# Altium project W2-FRONT.PrjPcb
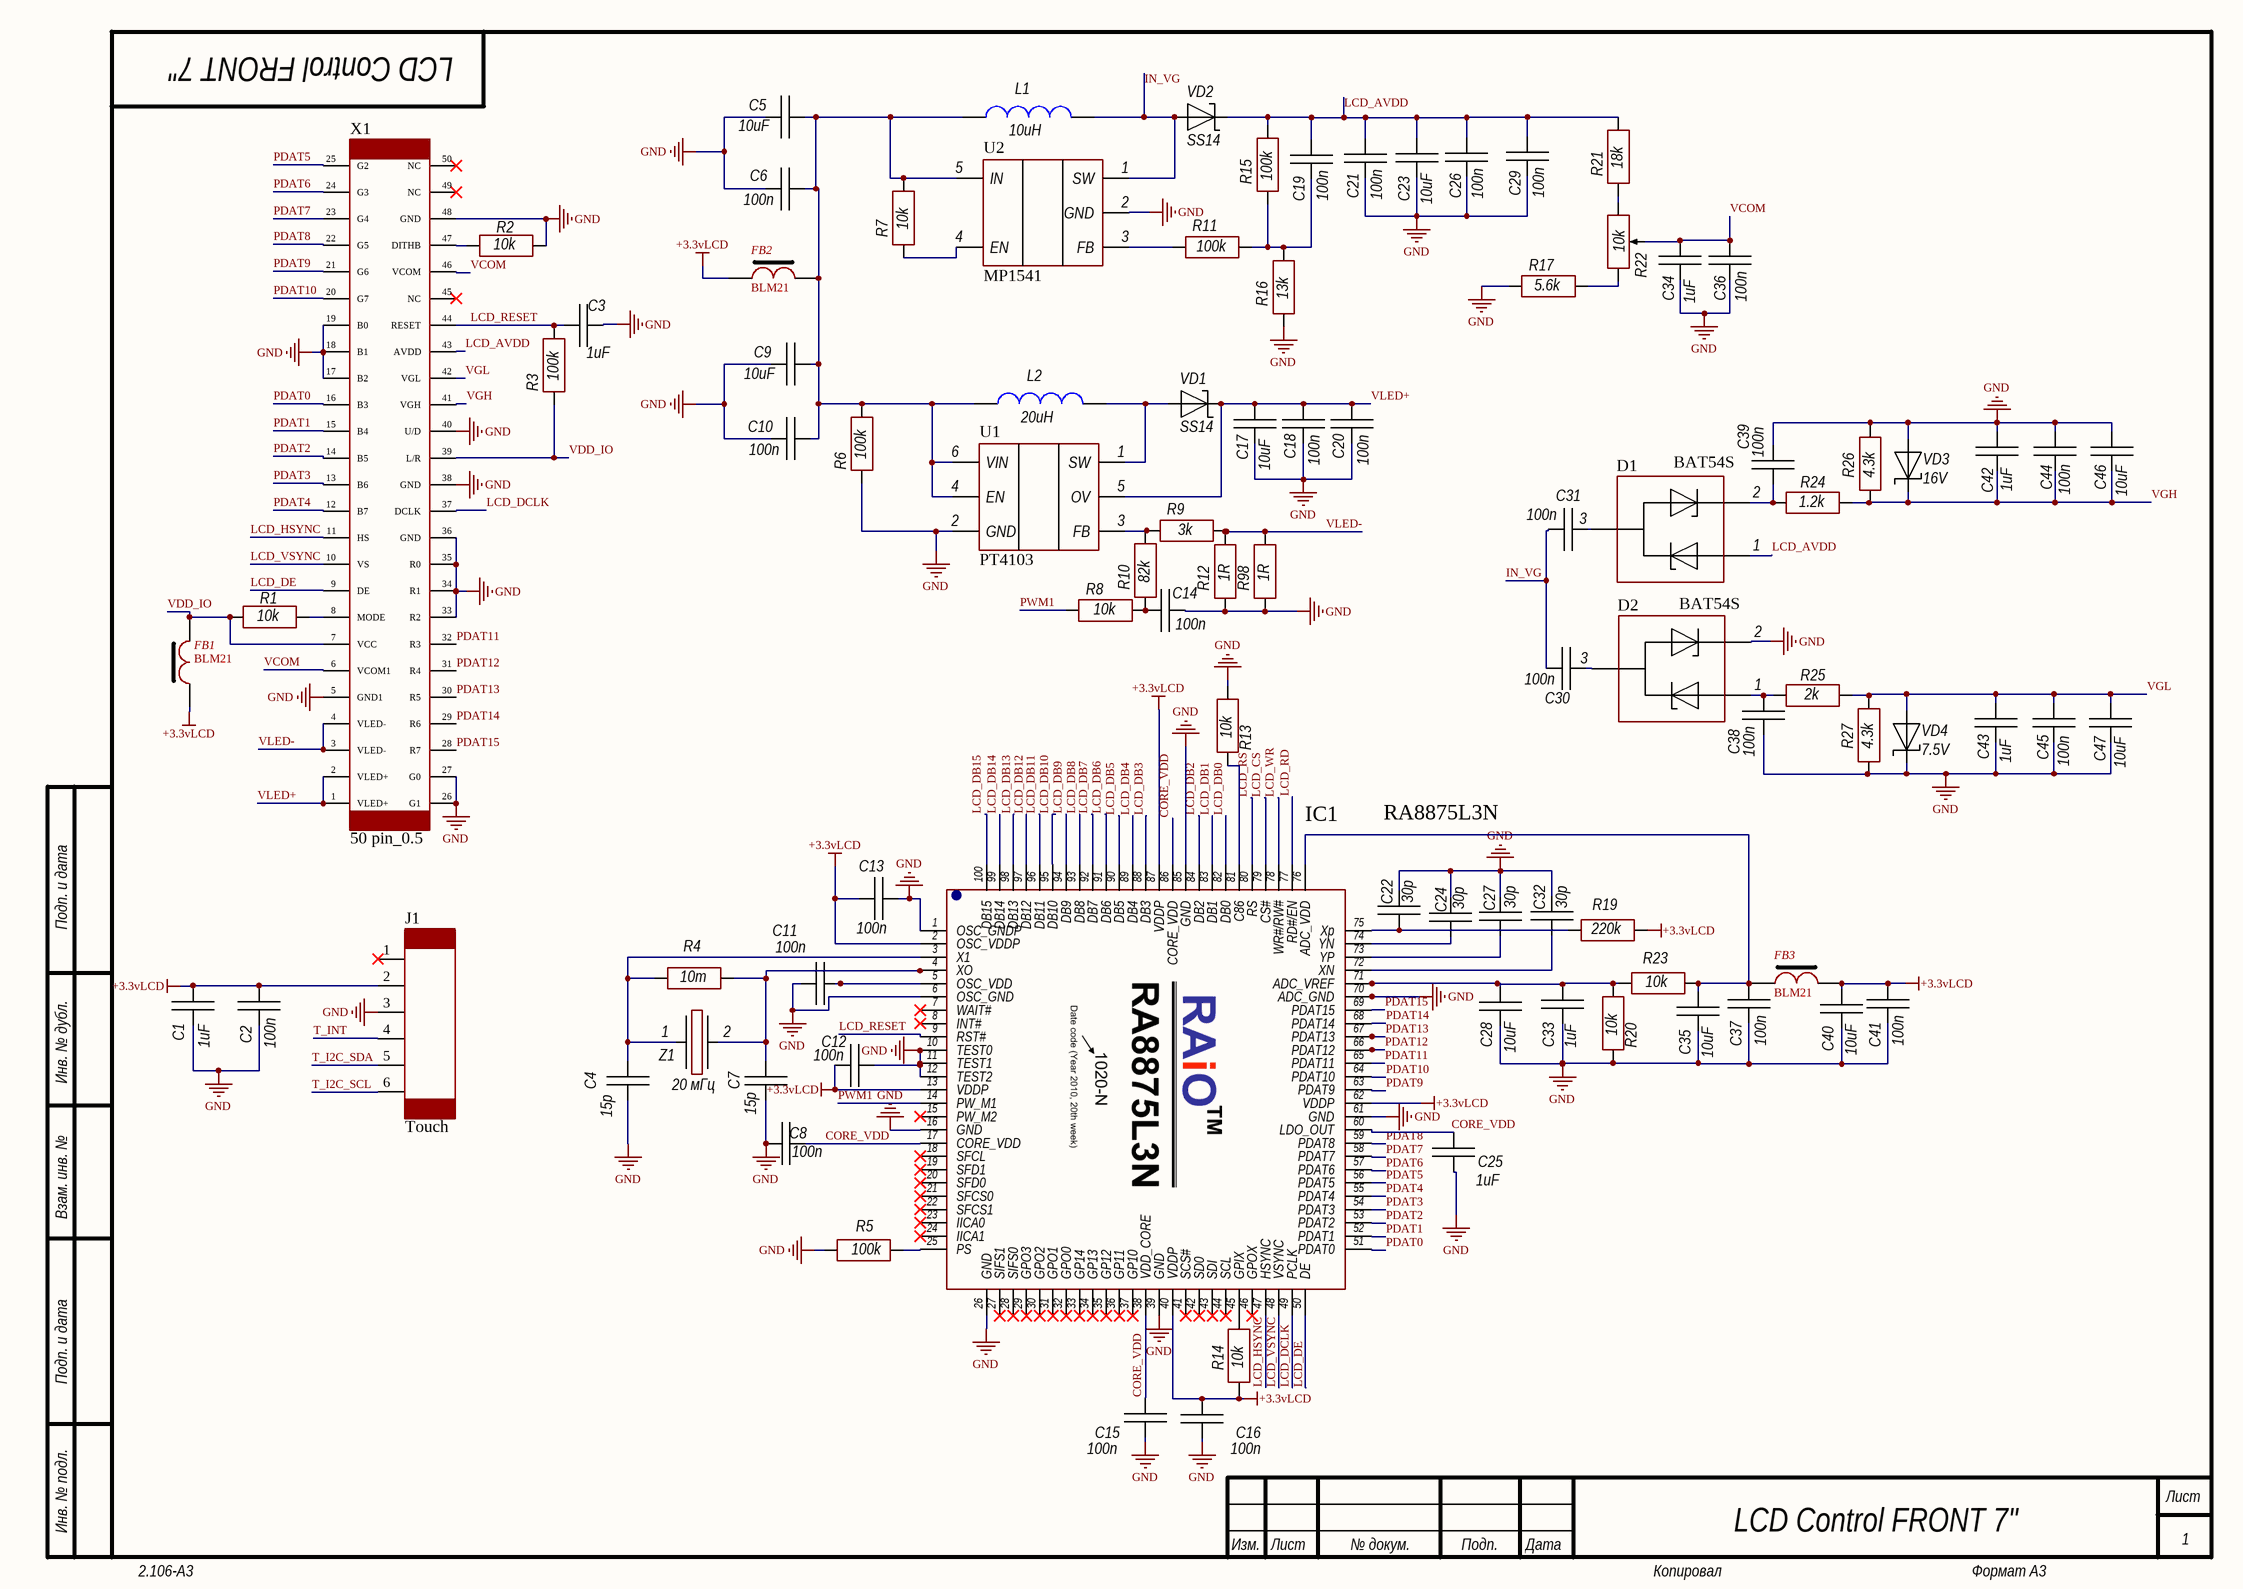
[diagram p0: LCD.SchDoc]
6 sheets, 320 parts. Net scope: global (net labels, ports and power ports of the same name join across sheets).
Board file: PCB_FRONT.PcbDoc
Sheets:
  LCD.SchDoc
  Power.SchDoc
  Conn.SchDoc
  Codec.SchDoc
  STM32.SchDoc
  Control.SchDoc

## Sheet LCD.SchDoc
size 420 x 297 mm; Address1: Address1; Address2: Address2; Address3: Address3; Address4: Address4; DocumentNumber: LCD Control FRONT 7"; SheetNumber: 1; SheetTotal: 6; Scale: 1:1; DocumentType: Схема электрическая принципиальная; FirstReferrence: АБВГ.123456.001

### Parts
C1  1uF  [CH0805C]
C2  100n  [CH0805C]
C3  1uF  [CH0603C]
C4  15p  [CH0603C]
C5  10uF  [CH1206C]
C6  100n  [CH0603C]
C7  15p  [CH0603C]
C8  100n  [CH0603C]
C9  10uF  [CH1206C]
C10  100n  [CH0603C]
C11  100n  [CH0603C]
C12  100n  [CH0603C]
C13  100n  [CH0603C]
C14  100n  [CH0603C]
C15  100n  [CH0603C]
C16  100n  [CH0603C]
C17  10uF  [CH1206C]
C18  100n  [CH0603C]
C19  100n  [CH0603C]
C20  100n  [CH0603C]
C21  100n  [CH0603C]
C22  30p  [CH0603C]
C23  10uF  [CH1206C]
C24  30p  [CH0603C]
C25  1uF  [CH0603C]
C26  100n  [CH0603C]
C27  30p  [CH0603C]
C28  10uF  [CH1206C]
C29  100n  [CH0603C]
C30  100n  [CH0603C]
C31  100n  [CH0603C]
C32  30p  [CH0603C]
C33  1uF  [CH0603C]
C34  1uF  [CH1206C]
C35  10uF  [CH1206C]
C36  100n  [CH0603C]
C37  100n  [CH0603C]
C38  100n  [CH0603C]
C39  100n  [CH0603C]
C40  10uF  [CH1206C]
C41  100n  [CH0603C]
C42  1uF  [CH0603C]
C43  1uF  [CH0603C]
C44  100n  [CH0603C]
C45  100n  [CH0603C]
C46  10uF  [CH1206C]
C47  10uF  [CH1206C]
D1  BAT54S  [SOT23_132]
D2  BAT54S  [SOT23_132]
FB1  BLM21  [CH0805L]
FB2  BLM21  [CH0805L]
FB3  BLM21  [CH0805L]
IC1  RA8875L3N  [100-LQFP]
J1  Touch  [FFC-6PIN]
L1  10uH  [IND: SDR0403]
L2  20uH  [IND: SDR0403]
R1  10k  [CH0603R]
R2  10k  [CH0603R]
R3  100k  [CH0603R]
R4  10m  [CH0603R]
R5  100k  [CH0603R]
R6  100k  [CH0603R]
R7  10k  [CH0603R]
R8  10k  [CH0603R]
R9  3k  [CH0603R]
R10  82k  [CH0603R]
R11  100k  [CH0603R]
R12  1R  [CH0603R]
R13  10k  [CH0603R]
R14  10k  [CH0603R]
R15  100k  [CH0603R]
R16  13k  [CH0603R]
R17  5.6k  [CH0603R]
R19  220k  [CH0603R]
R20  10k  [CH0603R]
R21  18k  [CH0603R]
R22  10k  [RES: 3314G]
R23  10k  [CH0603R]
R24  1.2k  [CH0603R]
R25  2k  [CH0603R]
R26  4.3k  [CH0603R]
R27  4.3k  [CH0603R]
R98  1R  [CH0603R]
U1  PT4103  [SOT23-6-ASM]
U2  MP1541  [SOT23-5]
VD1  SS14  [SMA]
VD2  SS14  [SMA]
VD3  16V  [SOD123]
VD4  7.5V  [SOD123]
X1  50 pin_0.5  [FFC FPC 50]
Z1  20 мГц  [OSC: Hz]

### Nets
+3.3vLCD: C1.2 C2.2 C12.1 C13.1 C16.2 C40.2 C41.2 FB1.2 FB2.2 FB3.1 IC1.2(OSC_VDDP) IC1.13(VDDP) IC1.40(VDDP) IC1.62(VDDP) IC1.87(VDDP) J1.2(B0) R14.1 R19.2
GND: C1.1 C2.1 C3.2 C4.1 C5.1 C6.1 C7.1 C8.1 C9.1 C10.1 C11.1 C12.2 C13.2 C14.2 C15.1 C16.1 C17.1 C18.1 C20.1 C21.1 C22.2 C23.1 C24.2 C25.1 C26.1 C27.2 C28.1 C29.1 C32.2 C33.1 C34.1 C35.1 C36.1 C37.1 C38.1 C39.2 C40.1 C41.1 C42.2 C43.1 C44.2 C45.1 C46.2 C47.1 D2.2 IC1.1(OSC_GNDP) IC1.6(OSC_GND) IC1.10(TEST0) IC1.11(TEST1) IC1.12(TEST2) IC1.16(GND) IC1.26(GND) IC1.39(GND) IC1.61(GND) IC1.70(ADC_GND) IC1.85(GND) J1.3(B1) R2.2 R5.1 R6.1 R12.1 R13.2 R16.1 R17.1 R20.1 R26.2 R27.1 R98.1 U1.2(GND) U2.2(GND) VD3.1 VD4.2 X1.5(GND1) X1.17(B2) X1.18(B1) X1.19(B0) X1.26(G1) X1.27(G0) X1.33(R2) X1.34(R1) X1.35(R0) X1.36(GND) X1.38(GND) X1.40(U/D) X1.48(GND)
CORE_VDD: C8.2 C15.2 C25.2 IC1.17(CORE_VDD) IC1.38(VDD_CORE) IC1.60(LDO_OUT) IC1.86(CORE_VDD)
IN_VG: C30.1 C31.1 L1.1 U2.1(SW) VD2.1
LCD_AVDD: C19.2 C21.2 C23.2 C26.2 C29.2 D1.1 R15.2 R21.2 VD2.2 X1.43(AVDD)
LCD_CS: IC1.79(CS#)
LCD_DB0: IC1.82(DB0)
LCD_DB1: IC1.83(DB1)
LCD_DB2: IC1.84(DB2)
LCD_DB3: IC1.88(DB3)
LCD_DB4: IC1.89(DB4)
LCD_DB5: IC1.90(DB5)
LCD_DB6: IC1.91(DB6)
LCD_DB7: IC1.92(DB7)
LCD_DB8: IC1.93(DB8)
LCD_DB9: IC1.94(DB9)
LCD_DB10: IC1.95(DB10)
LCD_DB11: IC1.96(DB11)
LCD_DB12: IC1.97(DB12)
LCD_DB13: IC1.98(DB13)
LCD_DB14: IC1.99(DB14)
LCD_DB15: IC1.100(DB15)
LCD_DCLK: IC1.49(PCLK) X1.37(DCLK)
LCD_DE: IC1.50(DE) X1.9(DE)
LCD_HSYNC: IC1.47(HSYNC) X1.11(HS)
LCD_RD: IC1.77(RD#/EN)
LCD_RESET: C3.1 IC1.9(RST#) R3.2 X1.44(RESET)
LCD_RS: IC1.80(RS)
LCD_VSYNC: IC1.48(VSYNC) X1.10(VS)
LCD_WR: IC1.78(WR#/RW#)
PDAT0: IC1.51(PDAT0) X1.16(B3)
PDAT1: IC1.52(PDAT1) X1.15(B4)
PDAT2: IC1.53(PDAT2) X1.14(B5)
PDAT3: IC1.54(PDAT3) X1.13(B6)
PDAT4: IC1.55(PDAT4) X1.12(B7)
PDAT5: IC1.56(PDAT5) X1.25(G2)
PDAT6: IC1.57(PDAT6) X1.24(G3)
PDAT7: IC1.58(PDAT7) X1.23(G4)
PDAT8: IC1.59(PDAT8) X1.22(G5)
PDAT9: IC1.63(PDAT9) X1.21(G6)
PDAT10: IC1.64(PDAT10) X1.20(G7)
PDAT11: IC1.65(PDAT11) X1.32(R3)
PDAT12: IC1.66(PDAT12) X1.31(R4)
PDAT13: IC1.67(PDAT13) X1.30(R5)
PDAT14: IC1.68(PDAT14) X1.29(R6)
PDAT15: IC1.69(PDAT15) X1.28(R7)
PWM1: IC1.14(PW_M1) R8.1
T_I2C_SCL: J1.6(B4)
T_I2C_SDA: J1.5(B3)
T_INT: J1.4(B2)
VCOM: C34.2 C36.2 R22.2 X1.6(VCOM1) X1.46(VCOM)
VDD_IO: FB1.1 R1.1 R3.1 X1.7(VCC) X1.39(L/R)
VGH: C42.1 C44.1 C46.1 R24.2 R26.1 VD3.2 X1.41(VGH)
VGL: C43.2 C45.2 C47.2 R25.2 R27.2 VD4.1 X1.42(VGL)
VLED+: C17.2 C18.2 C20.2 U1.5(OV) VD1.2 X1.1(VLED+) X1.2(VLED+)
VLED-: R9.2 R12.2 R98.2 X1.3(VLED-) X1.4(VLED-)
NetC4_2: C4.2 IC1.3(X1) R4.1 Z1.1
NetC5_2: C5.2 C6.2 C9.2 C10.2 FB2.1 L1.2 L2.2 R6.2 R7.2 U1.4(EN) U1.6(VIN) U2.5(IN)
NetC7_2: C7.2 IC1.4(XO) R4.2 Z1.2
NetC11_2: C11.2 IC1.5(OSC_VDD)
NetC14_1: C14.1 R8.2 R10.1
NetC19_1: C19.1 R11.2 R15.1 R16.2
NetC22_1: C22.1 IC1.75(Xp) R19.1
NetC24_1: C24.1 IC1.74(YN)
NetC27_1: C27.1 IC1.73(YP)
NetC28_2: C28.2 C33.2 IC1.71(ADC_VREF) R20.2 R23.1
NetC30_2: C30.2 D2.3
NetC31_2: C31.2 D1.3
NetC32_1: C32.1 IC1.72(XN)
NetC35_2: C35.2 C37.2 FB3.2 IC1.76(ADC_VDD) R23.2
NetC38_2: C38.2 D2.1 R25.1
NetC39_1: C39.1 D1.2 R24.1
NetIC1_25: IC1.25(PS) R5.2
NetIC1_45: IC1.45(GPIX) R14.2
NetIC1_81: IC1.81(C86) R13.1
NetL2_1: L2.1 U1.1(SW) VD1.1
NetR1_2: R1.2 X1.8(MODE)
NetR2_1: R2.1 X1.47(DITHB)
NetR7_1: R7.1 U2.4(EN)
NetR9_1: R9.1 R10.2 U1.3(FB)
NetR11_1: R11.1 U2.3(FB)
NetR17_2: R17.2 R22.3
NetR21_1: R21.1 R22.1

Not connected (* = marked no-connect by the designer): IC1 7(WAIT#)* 8(INT#)* 15(PW_M2)* 18(SFCL)* 19(SFD1)* 20(SFD0)* 21(SFCS0)* 22(SFCS1)* 23(IICA0)* 24(IICA1)* 27(SIFS1)* 28(SIFS0)* 29(GPO3)* 30(GPO2)* 31(GPO1)* 32(GPO0)* 33(GP14)* 34(GP13)* 35(GP12)* 36(GP11)* 37(GP10)* 41(SCS#)* 42(SD0)* 43(SDI)* 44(SCL)* 46(GPOX)*; J1 1(G7)*; X1 45(NC)* 49(NC)* 50(NC)*

### Notes on the sheet
- Подп. и дата
- Инв. № дубл.
- Взам. инв. №
- Инв. № подл.
- Изм.
- Лист
- № докум.
- Подп.
- Дата
- 2.106-A3
- Копировал
- Формат А3
- (in symbol RA8875) .

### Library data of the parts
C1-C47 = Capacitor: Manufacturer: *; Model: *; HelpURL: *; ComponentKind: *; Value: *
D1 D2 = BAT54
FB1-FB3 = FB-1
IC1 = RA8875
J1 = 6-Conn
L1 L2 = Inductor: Manufacturer: *; Model: *; HelpURL: *; ComponentKind: *; Value: *
R1-R17 R19-R21 R23-R27 R98 = Resistor: Manufacturer: *; Model: *; HelpURL: *; ComponentKind: *; Value: *
R22 = ADJ resistor: Manufacturer: *; Model: *; HelpURL: *; ComponentKind: *; Value: *
U1 = MP3202
VD1-VD4 = Diod Schottky: ComponentKind: *; Manufacturer: *; Model: *; HelpURL: *
X1 = 50-Conn
Z1 = Oscillator: Manufacturer: *; Model: *; HelpURL: *; ComponentKind: *; Value: *

## Sheet Power.SchDoc
size 420 x 297 mm; Address1: Address1; Address2: Address2; Address3: Address3; Address4: Address4; DocumentNumber: Power FRONT 7"; SheetNumber: 2; SheetTotal: 6; Scale: 1:1; DocumentType: Схема электрическая принципиальная; FirstReferrence: АБВГ.123456.001
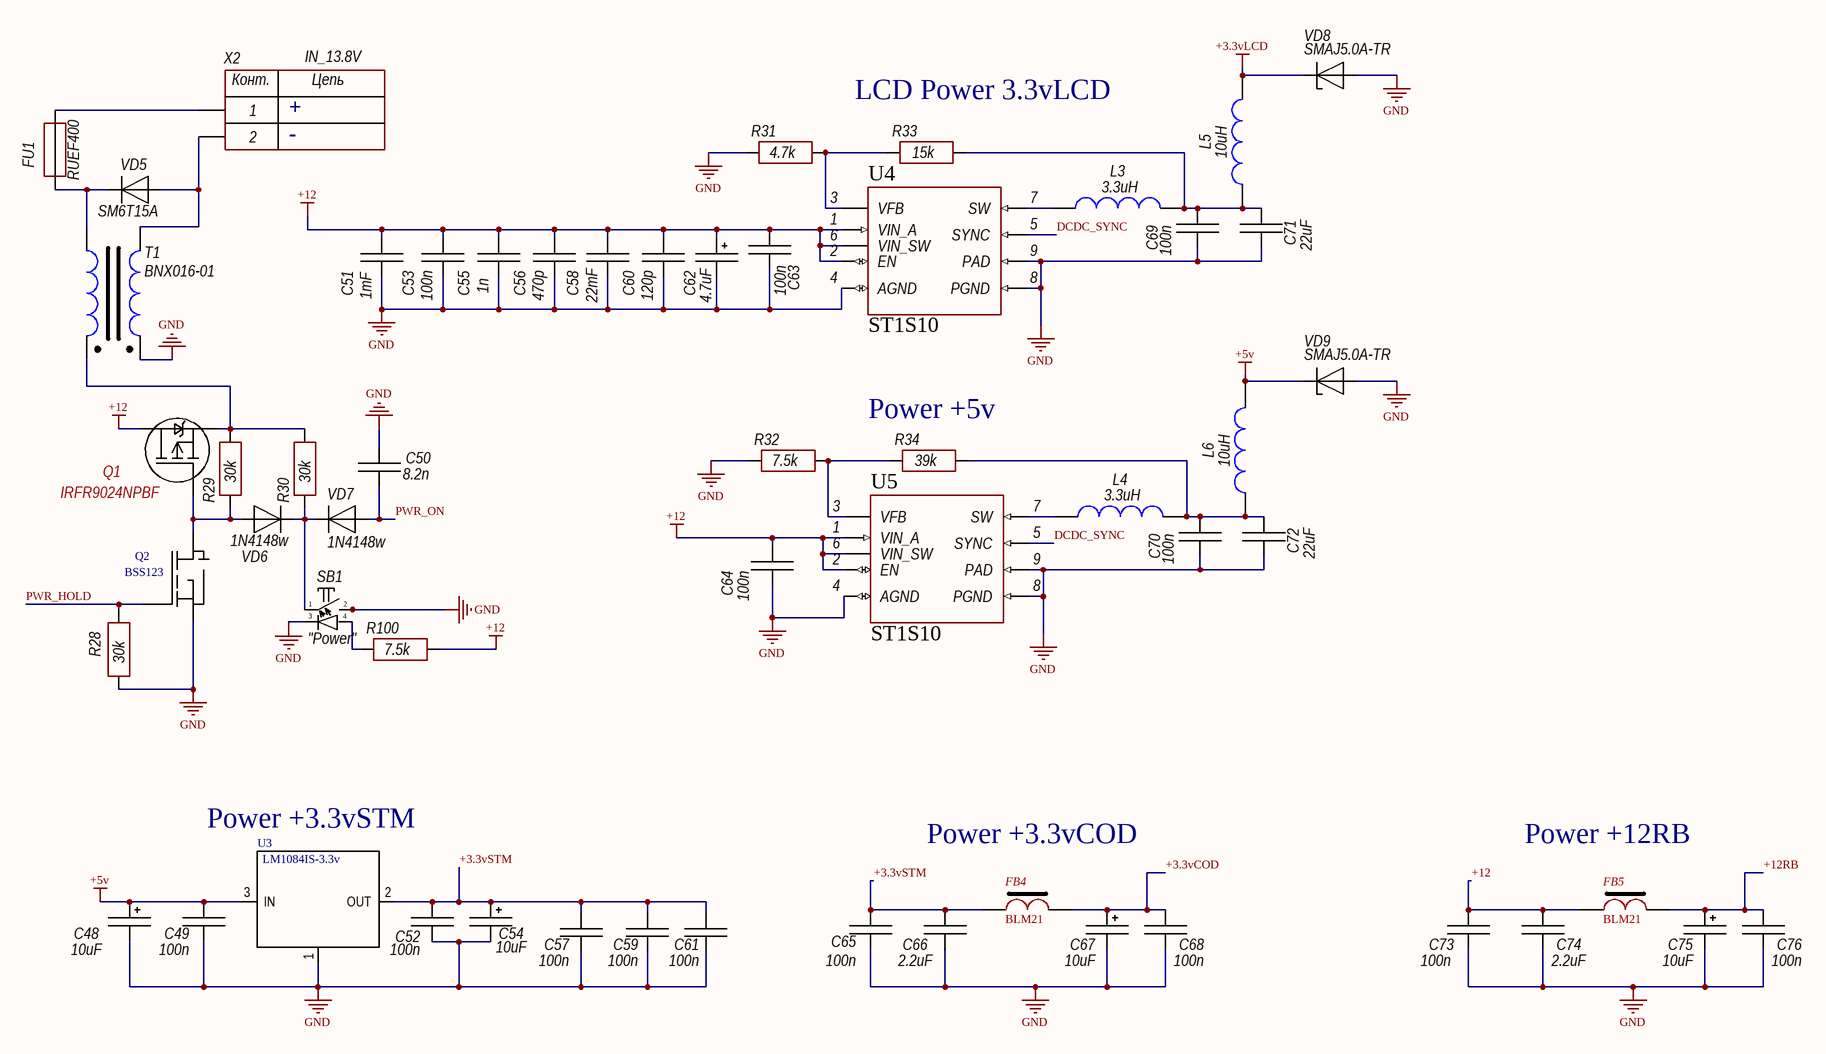
[diagram p1: Power.SchDoc]

### Parts
C48  10uF  [TANTAL_B]
C49  100n  [CH0805C]
C50  8.2n  [CH0805C]
C51  1mF  [CH0805C]
C52  100n  [CH0805C]
C53  100n  [CH0805C]
C54  10uF  [TANTAL_B]
C55  1n  [CH0805C]
C56  470p  [CH0805C]
C57  100n  [CH0805C]
C58  22mF  [CH1210C]
C59  100n  [CH0805C]
C60  120p  [CH0805C]
C61  100n  [CH0805C]
C62  4.7uF  [D6.3C2.5H11]
C63  100n  [CH0805C]
C64  100n  [CH0805C]
C65  100n  [CH0805C]
C66  2.2uF  [CH0805C]
C67  10uF  [TANTAL_B]
C68  100n  [CH0805C]
C69  100n  [CH0805C]
C70  100n  [CH0805C]
C71  22uF  [CH1210C]
C72  22uF  [CH1210C]
C73  100n  [CH0805C]
C74  2.2uF  [CH0805C]
C75  10uF  [TANTAL_B]
C76  100n  [CH0805C]
FB4  BLM21  [CH0805L]
FB5  BLM21  [CH0805L]
FU1  RUEF400  [Fuse: Ruef400]
L3  3.3uH  [IND: CDRH74]
L4  3.3uH  [IND: CDRH127]
L5  10uH  [IND: CDRH74]
L6  10uH  [IND: CDRH74]
Q1  IRFR9024NPBF  [D2PAK_132]
Q2  BSS123  [SOT23_132]
R28  30k  [CH0805R]
R29  30k  [CH0805R]
R30  30k  [CH0805R]
R31  4.7k  [CH0805R]
R32  7.5k  [CH0805R]
R33  15k  [CH0805R]
R34  39k  [CH0805R]
R100  7.5k  [CH0805R]
SB1  "Power"  [BUT: 6x6 LED]
T1  BNX016-01  [BNX016-01]
U3  LM1084IS-3.3v  [TO-263-3(123)]
U4  ST1S10  [8-SOIC (PAD)]
U5  ST1S10  [8-SOIC (PAD)]
VD5  SM6T15A  [SMB]
VD6  1N4148w  [SOD123F]
VD7  1N4148w  [SOD123F]
VD8  SMAJ5.0A-TR  [SMA]
VD9  SMAJ5.0A-TR  [SMA]
X2  IN_13.8V  [CON: WF-02]

### Nets
+3.3vCOD: C67.1 C68.2 FB4.1
+3.3vLCD: L5.1 VD8.2(C)
+3.3vSTM: C52.2 C54.1 C57.2 C59.2 C61.2 C65.2 C66.2 FB4.2 U3.2(OUT)
+5v: C48.1 C49.2 L6.1 U3.3(IN) VD9.2(C)
+12: C51.2 C53.2 C55.2 C56.2 C58.2 C60.2 C62.1 C63.2 C64.2 C73.2 C74.2 FB5.2 Q1.3(Сток(Drain)) R100.2 U4.1(VIN_A) U4.2(EN) U4.6(VIN_SW) U5.1(VIN_A) U5.2(EN) U5.6(VIN_SW)
+12RB: C75.1 C76.2 FB5.1
GND: C48.2 C49.1 C50.2 C51.1 C52.1 C53.1 C54.2 C55.1 C56.1 C57.1 C58.1 C59.1 C60.1 C61.1 C62.2 C63.1 C64.1 C65.1 C66.1 C67.2 C68.1 C69.1 C70.1 C71.1 C72.1 C73.1 C74.1 C75.2 C76.1 Q2.2(S) R28.1 R31.1 R32.1 SB1.2 SB1.3 T1.3 U3.1 U4.4(AGND) U4.8(PGND) U4.9(PAD) U5.4(AGND) U5.8(PGND) U5.9(PAD) VD8.1(A) VD9.1(A)
DCDC_SYNC: U4.5(SYNC) U5.5(SYNC)
PWR_HOLD: Q2.1(G) R28.2
PWR_ON: C50.1 VD7.1
NetC69_2: C69.2 C71.2 L3.1 L5.2 R33.2
NetC70_2: C70.2 C72.2 L4.1 L6.2 R34.2
NetFU1_1: FU1.1 T1.2 VD5.2
NetFU1_2: FU1.2 X2.1
NetL3_2: L3.2 U4.7(SW)
NetL4_2: L4.2 U5.7(SW)
NetQ1_1: Q1.1(Затвор(Gate)) Q2.3(D) R29.1 VD6.1
NetQ1_2: Q1.2(I) R29.2 R30.2 T1.1
NetR30_1: R30.1 SB1.1 VD6.2 VD7.2
NetR31_2: R31.2 R33.1 U4.3(VFB)
NetR32_2: R32.2 R34.1 U5.3(VFB)
NetR100_1: R100.1 SB1.4
NetT1_4: T1.4 VD5.1 X2.2

### Notes on the sheet
- +
- -
- LCD Power 3.3vLCD
- (near R34) Power +5v
- Power +3.3vSTM
- Power +3.3vCOD
- Power +12RB
- Подп. и дата
- Инв. № дубл.
- Взам. инв. №
- Инв. № подл.
- Изм.
- Лист
- № докум.
- Подп.
- Дата
- 2.106-A3
- Копировал
- Формат А3
- (in symbol 2-Connector) Конт.; Цепь

### Library data of the parts
C48 C54 C67 C75 = TantalCap: Manufacturer: *; Model: *; HelpURL: *; ComponentKind: *; Value: *
C49-C53 C55-C61 C63-C66 C68-C74 C76 = Capacitor: Manufacturer: *; Model: *; HelpURL: *; ComponentKind: *; Value: *
C62 = AlumCap: Manufacturer: *; Model: *; HelpURL: *; ComponentKind: *; Value: *
FB4 FB5 = FB-1
FU1 = Fuse: Manufacturer: *; Model: *; HelpURL: *; ComponentKind: *; Value: *
L3-L6 = Inductor: Manufacturer: *; Model: *; HelpURL: *; ComponentKind: *; Value: *
Q1 = P-KANAL
R28-R34 R100 = Resistor: Manufacturer: *; Model: *; HelpURL: *; ComponentKind: *; Value: *
SB1 = Tactile switches_LED: 6x6 mm; Manufacturer: *; Model: *; HelpURL: *; ComponentKind: *
T1 = EMI bead: Manufacturer: Murata Electronics North America; Model: DLW21SN900SQ2L; HelpURL: https://www.digikey.com/product-detail/en/murata-electronics-north-america/DLW21SN900SQ2L/490-5137-1-ND/1922888; ComponentKind: Bead
U3 = LM1084
VD5-VD7 = Diod: ComponentKind: *; Manufacturer: *; Model: *; HelpURL: *
VD8 VD9 = Diod Zener: ComponentKind: *; Manufacturer: *; Model: *; HelpURL: *
X2 = 2-Connector: Model: *; Manufacturer: *; HelpURL: *; ComponentKind: *

## Sheet Conn.SchDoc: Connectros
size 420 x 297 mm; Author: UA3REO; CompanyName: Wolf Team; Engineer: UA3REO; DocumentNumber: Connectors FRONT 7'; Revision: 0.1; SheetNumber: 3; SheetTotal: 6
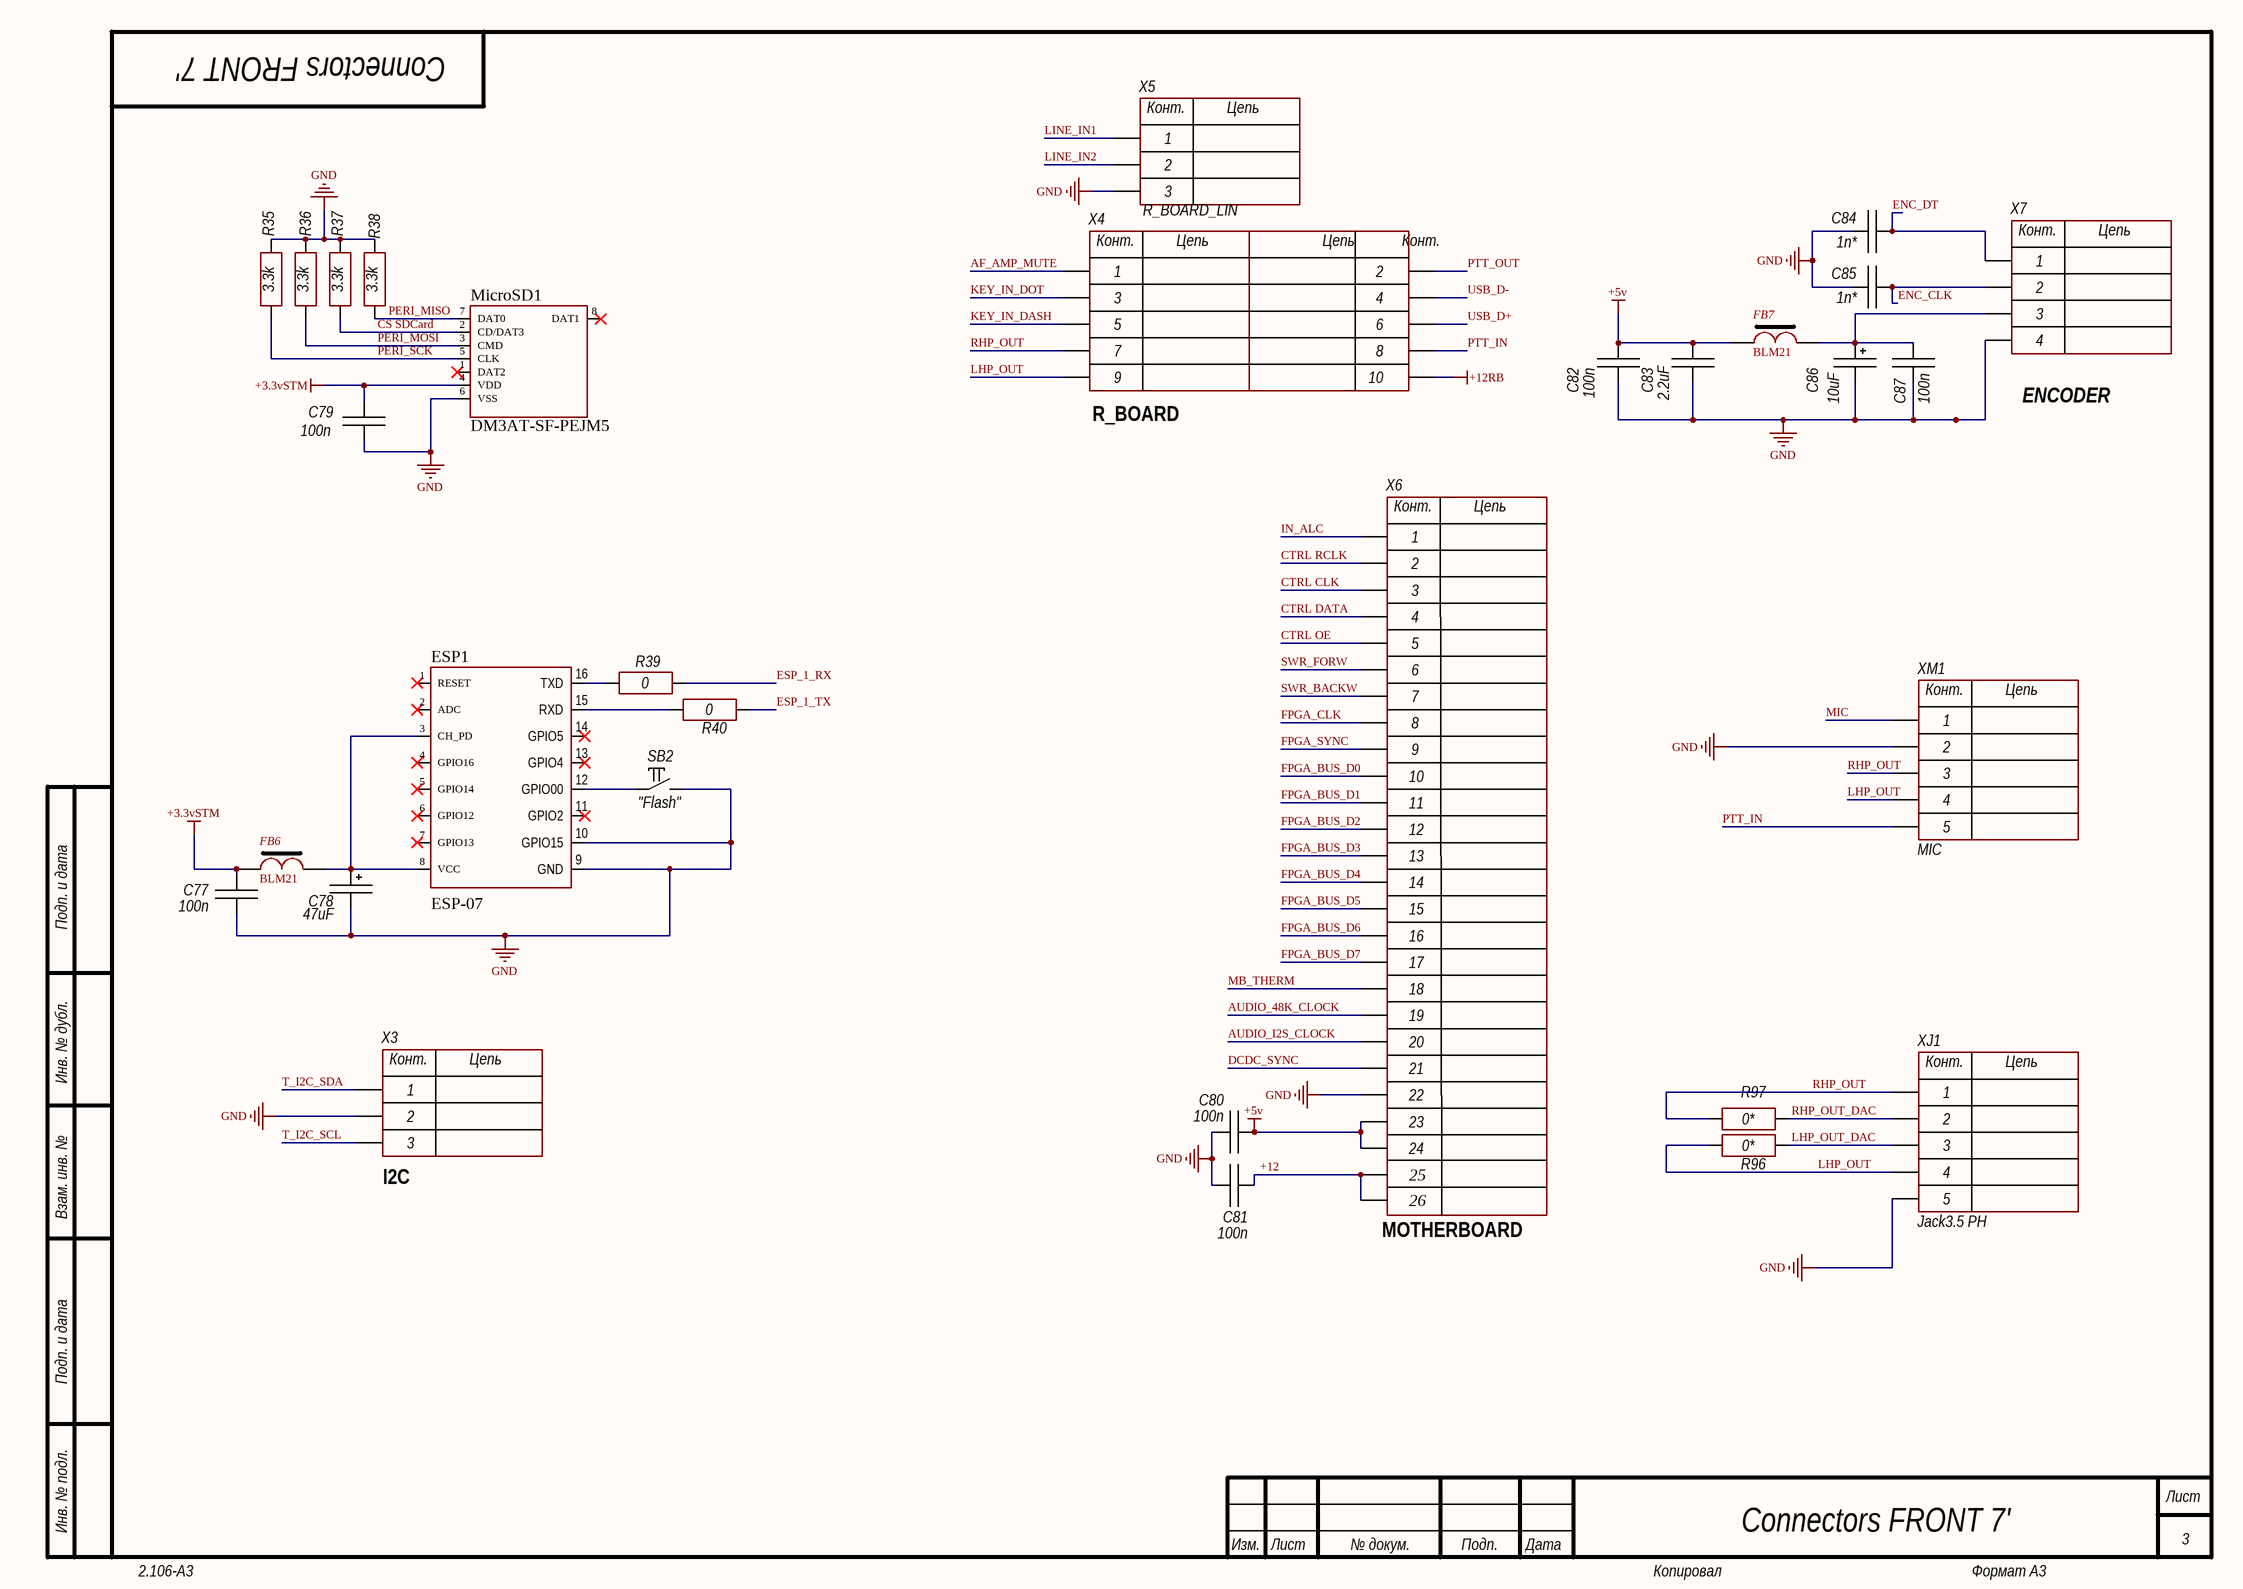
[diagram p2: Conn.SchDoc]

### Parts
C77  100n  [CH0805C]
C78  47uF  [TANTAL_C]
C79  100n  [CH0805C]
C80  100n  [CH0805C]
C81  100n  [CH0805C]
C82  100n  [CH0805C]
C83  2.2uF  [CH0805C]
C84  1n*  [CH0805C]
C85  1n*  [CH0805C]
C86  10uF  [TANTAL_B]
C87  100n  [CH0805C]
ESP1  ESP-07  [ESP8266 ESP-07]
FB6  BLM21  [CH0805L]
FB7  BLM21  [CH0805L]
MicroSD1  DM3AT-SF-PEJM5  [SD-card]
R35  3.3k  [CH0805R]
R36  3.3k  [CH0805R]
R37  3.3k  [CH0805R]
R38  3.3k  [CH0805R]
R39  0  [CH0603R]
R40  0  [CH0603R]
R96  0*  [CH0603R]
R97  0*  [CH0603R]
SB2  "Flash"  [BUT: 6x6 SMD]
X3  I2C  [CON: CWF-3]
X4  R_BOARD  [CON: BH-10]
X5  R_BOARD_LIN  [CON: CWF-3]
X6  MOTHERBOARD  [CON: IDC-26]
X7  ENCODER  [CON: CWF-4]
XJ1  Jack3.5 PH  [CON: PLS-5]
XM1  MIC  [CON: PLS-5]

### Nets
+3.3vSTM: C77.2 C79.2 FB6.2 MicroSD1.4(VDD)
+5v: C80.1 C82.2 C83.2 FB7.2 X6.23 X6.24
+12: C81.1 X6.25 X6.26
+12RB: X4.10
GND: C77.1 C78.2 C79.1 C80.2 C81.2 C82.1 C83.1 C84.1 C85.1 C86.2 C87.1 ESP1.9(GND) ESP1.10(GPIO15) MicroSD1.6(VSS) R35.2 R36.2 R37.2 R38.2 SB2.2 X3.2 X5.3 X6.22 X7.4 XJ1.5 XM1.2
AF_AMP_MUTE: X4.1
AUDIO_48K_CLOCK: X6.19
AUDIO_I2S_CLOCK: X6.20
CS SDCard: MicroSD1.2(CD/DAT3) R37.1
CTRL CLK: X6.3
CTRL DATA: X6.4
CTRL OE: X6.5
CTRL RCLK: X6.2
DCDC_SYNC: X6.21
ENC_CLK: C85.2 X7.2
ENC_DT: C84.2 X7.1
ESP_1_RX: R39.2
ESP_1_TX: R40.2
FPGA_BUS_D0: X6.10
FPGA_BUS_D1: X6.11
FPGA_BUS_D2: X6.12
FPGA_BUS_D3: X6.13
FPGA_BUS_D4: X6.14
FPGA_BUS_D5: X6.15
FPGA_BUS_D6: X6.16
FPGA_BUS_D7: X6.17
FPGA_CLK: X6.8
FPGA_SYNC: X6.9
IN_ALC: X6.1
KEY_IN_DASH: X4.5
KEY_IN_DOT: X4.3
LHP_OUT: R96.1 X4.9 XJ1.4 XM1.4
LHP_OUT_DAC: R96.2 XJ1.3
LINE_IN1: X5.1
LINE_IN2: X5.2
MB_THERM: X6.18
MIC: XM1.1
PERI_MISO: MicroSD1.7(DAT0) R38.1
PERI_MOSI: MicroSD1.3(CMD) R36.1
PERI_SCK: MicroSD1.5(CLK) R35.1
PTT_IN: X4.8 XM1.5
PTT_OUT: X4.2
RHP_OUT: R97.1 X4.7 XJ1.1 XM1.3
RHP_OUT_DAC: R97.2 XJ1.2
SWR_BACKW: X6.7
SWR_FORW: X6.6
T_I2C_SCL: X3.3
T_I2C_SDA: X3.1
USB_D+: X4.6
USB_D-: X4.4
NetC78_1: C78.1 ESP1.3(CH_PD) ESP1.8(VCC) FB6.1
NetC86_1: C86.1 C87.2 FB7.1 X7.3
NetESP1_12: ESP1.12(GPIO00) SB2.1
NetESP1_15: ESP1.15(RXD) R40.1
NetESP1_16: ESP1.16(TXD) R39.1

Not connected (* = marked no-connect by the designer): ESP1 1(RESET)* 2(ADC)* 4(GPIO16)* 5(GPIO14)* 6(GPIO12)* 7(GPIO13)* 11(GPIO2)* 13(GPIO4)* 14(GPIO5)*; MicroSD1 1(DAT2)* 8(DAT1)*

### Notes on the sheet
- Подп. и дата
- Инв. № дубл.
- Взам. инв. №
- Инв. № подл.
- Изм.
- Лист
- № докум.
- Подп.
- Дата
- 2.106-A3
- Копировал
- Формат А3
- (in symbol 3-Connector) Конт.; Цепь
- (in symbol 4-Connector) Конт.; Цепь
- (in symbol 5-Connector) Конт.; Цепь
- (in symbol 10(2)-Connector) Конт.; Цепь
- (in symbol 26-Connector) Конт.; Цепь

### Library data of the parts
C77 C79-C85 C87 = Capacitor: Manufacturer: *; Model: *; HelpURL: *; ComponentKind: *; Value: *
C78 C86 = TantalCap: Manufacturer: *; Model: *; HelpURL: *; ComponentKind: *; Value: *
FB6 FB7 = FB-1
MicroSD1 = MicroSD
R35-R40 R96 R97 = Resistor: Manufacturer: *; Model: *; HelpURL: *; ComponentKind: *; Value: *
SB2 = Tactile switches: 6x6 mm; Manufacturer: *; Model: *; HelpURL: *; ComponentKind: *
X3 X5 = 3-Connector: Model: *; Manufacturer: *; HelpURL: *; ComponentKind: *
X4 = 10(2)-Connector: Model: *; Manufacturer: *; HelpURL: *; ComponentKind: *
X6 = 26-Connector: Model: *; Manufacturer: *; HelpURL: *; ComponentKind: *
X7 = 4-Connector: Model: *; Manufacturer: *; HelpURL: *; ComponentKind: *
XJ1 XM1 = 5-Connector: Model: *; Manufacturer: *; HelpURL: *; ComponentKind: *

## Sheet Codec.SchDoc
size 420 x 297 mm; DocumentNumber: CODEC FRONT 7"; SheetNumber: 4; SheetTotal: 6
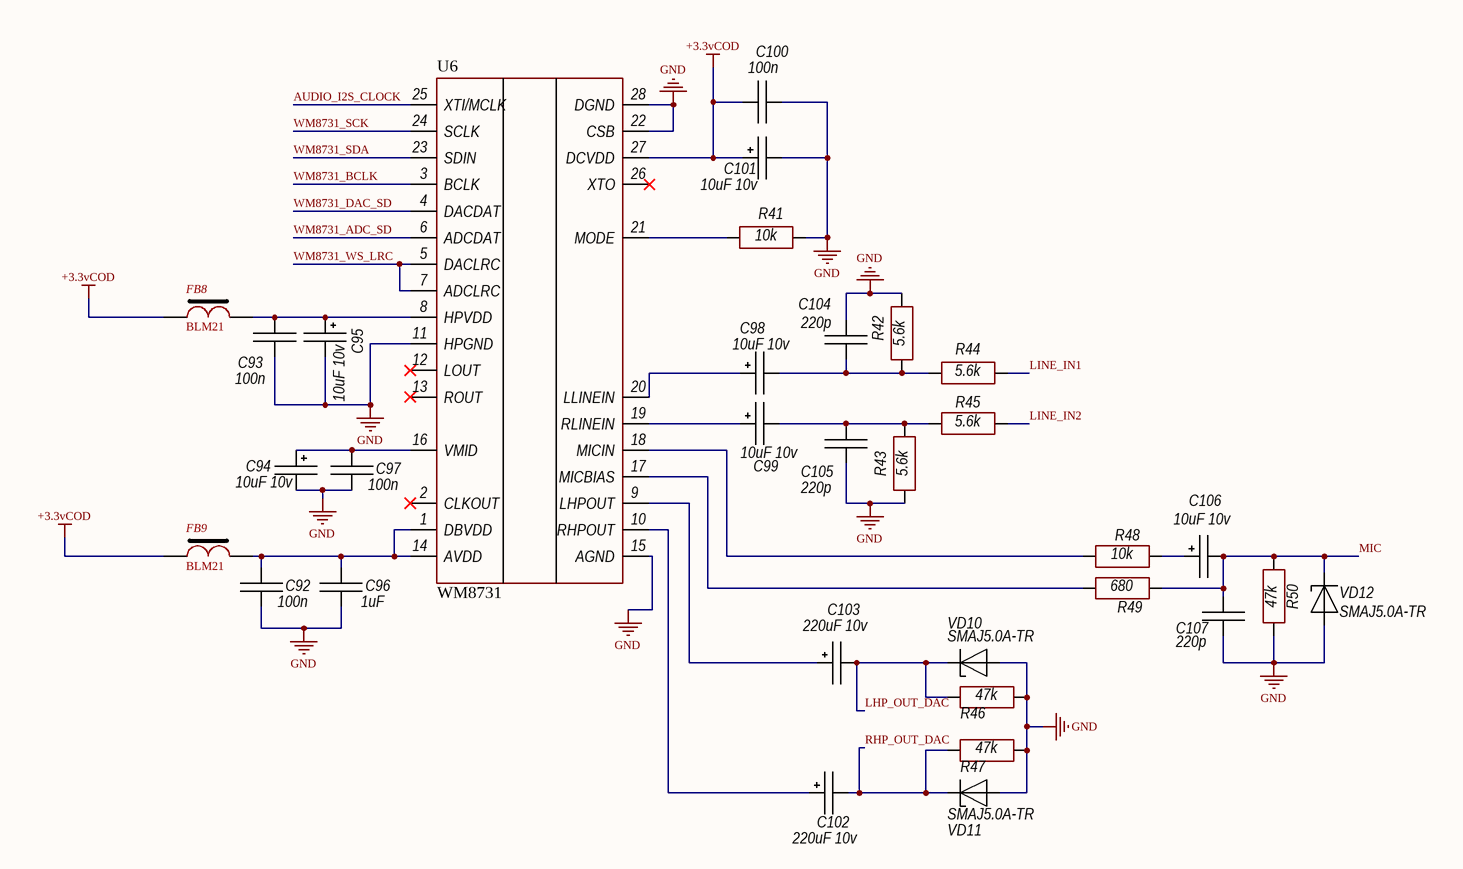
[diagram p3: Codec.SchDoc]

### Parts
C92  100n  [CH0805C]
C93  100n  [CH0805C]
C94  10uF 10v  [TANTAL_B]
C95  10uF 10v  [TANTAL_B]
C96  1uF  [CH0805C]
C97  100n  [CH0805C]
C98  10uF 10v  [TANTAL_B]
C99  10uF 10v  [TANTAL_B]
C100  100n  [CH0805C]
C101  10uF 10v  [TANTAL_B]
C102  220uF 10v  [TANTAL_D]
C103  220uF 10v  [TANTAL_D]
C104  220p  [CH0805C]
C105  220p  [CH0805C]
C106  10uF 10v  [TANTAL_B]
C107  220p  [CH0805C]
FB8  BLM21  [CH0805L]
FB9  BLM21  [CH0805L]
R41  10k  [CH0805R]
R42  5.6k  [CH0805R]
R43  5.6k  [CH0805R]
R44  5.6k  [CH0805R]
R45  5.6k  [CH0805R]
R46  47k  [CH0805R]
R47  47k  [CH0805R]
R48  10k  [CH0805R]
R49  680  [CH0805R]
R50  47k  [CH0805R]
U6  WM8731  [28-SSOP]
VD10  SMAJ5.0A-TR  [SMA]
VD11  SMAJ5.0A-TR  [SMA]
VD12  SMAJ5.0A-TR  [SMA]

### Nets
+3.3vCOD: C100.1 C101.1 FB8.2 FB9.2 U6.27(DCVDD)
GND: C92.1 C93.1 C94.2 C95.2 C96.1 C97.1 C100.2 C101.2 C104.2 C105.1 C107.2 R41.2 R42.2 R43.1 R46.2 R47.2 R50.1 U6.11(HPGND) U6.15(AGND) U6.22(CSB) U6.28(DGND) VD10.1(A) VD11.1(A) VD12.1(A)
AUDIO_I2S_CLOCK: U6.25(XTI/MCLK)
LHP_OUT_DAC: C103.2 R46.1 VD10.2(C)
LINE_IN1: R44.2
LINE_IN2: R45.2
MIC: C106.2 C107.1 R49.2 R50.2 VD12.2(C)
RHP_OUT_DAC: C102.2 R47.1 VD11.2(C)
WM8731_ADC_SD: U6.6(ADCDAT)
WM8731_BCLK: U6.3(BCLK)
WM8731_DAC_SD: U6.4(DACDAT)
WM8731_SCK: U6.24(SCLK)
WM8731_SDA: U6.23(SDIN)
WM8731_WS_LRC: U6.5(DACLRC) U6.7(ADCLRC)
NetC92_2: C92.2 C96.2 FB9.1 U6.1(DBVDD) U6.14(AVDD)
NetC93_2: C93.2 C95.1 FB8.1 U6.8(HPVDD)
NetC94_1: C94.1 C97.2 U6.16(VMID)
NetC98_1: C98.1 U6.20(LLINEIN)
NetC98_2: C98.2 C104.1 R42.1 R44.1
NetC99_1: C99.1 U6.19(RLINEIN)
NetC99_2: C99.2 C105.2 R43.2 R45.1
NetC102_1: C102.1 U6.10(RHPOUT)
NetC103_1: C103.1 U6.9(LHPOUT)
NetC106_1: C106.1 R48.2
NetR41_1: R41.1 U6.21(MODE)
NetR48_1: R48.1 U6.18(MICIN)
NetR49_1: R49.1 U6.17(MICBIAS)

Not connected (* = marked no-connect by the designer): U6 2(CLKOUT)* 12(LOUT)* 13(ROUT)* 26(XTO)*

### Notes on the sheet
- Подп. и дата
- Инв. № дубл.
- Взам. инв. №
- Инв. № подл.
- Изм.
- Лист
- № докум.
- Подп.
- Дата
- 2.106-A3
- Копировал
- Формат А3

### Library data of the parts
C92 C93 C96 C97 C100 C104 C105 C107 = Capacitor: Manufacturer: *; Model: *; HelpURL: *; ComponentKind: *; Value: *
C94 C95 C98 C99 C101-C103 C106 = TantalCap: Manufacturer: *; Model: *; HelpURL: *; ComponentKind: *; Value: *
FB8 FB9 = FB-1
R41-R50 = Resistor: Manufacturer: *; Model: *; HelpURL: *; ComponentKind: *; Value: *
VD10-VD12 = Diod Zener: ComponentKind: *; Manufacturer: *; Model: *; HelpURL: *

## Sheet STM32.SchDoc
size 420 x 297 mm; DocumentNumber: STM32 FRONT 7"; SheetNumber: 5; SheetTotal: 6
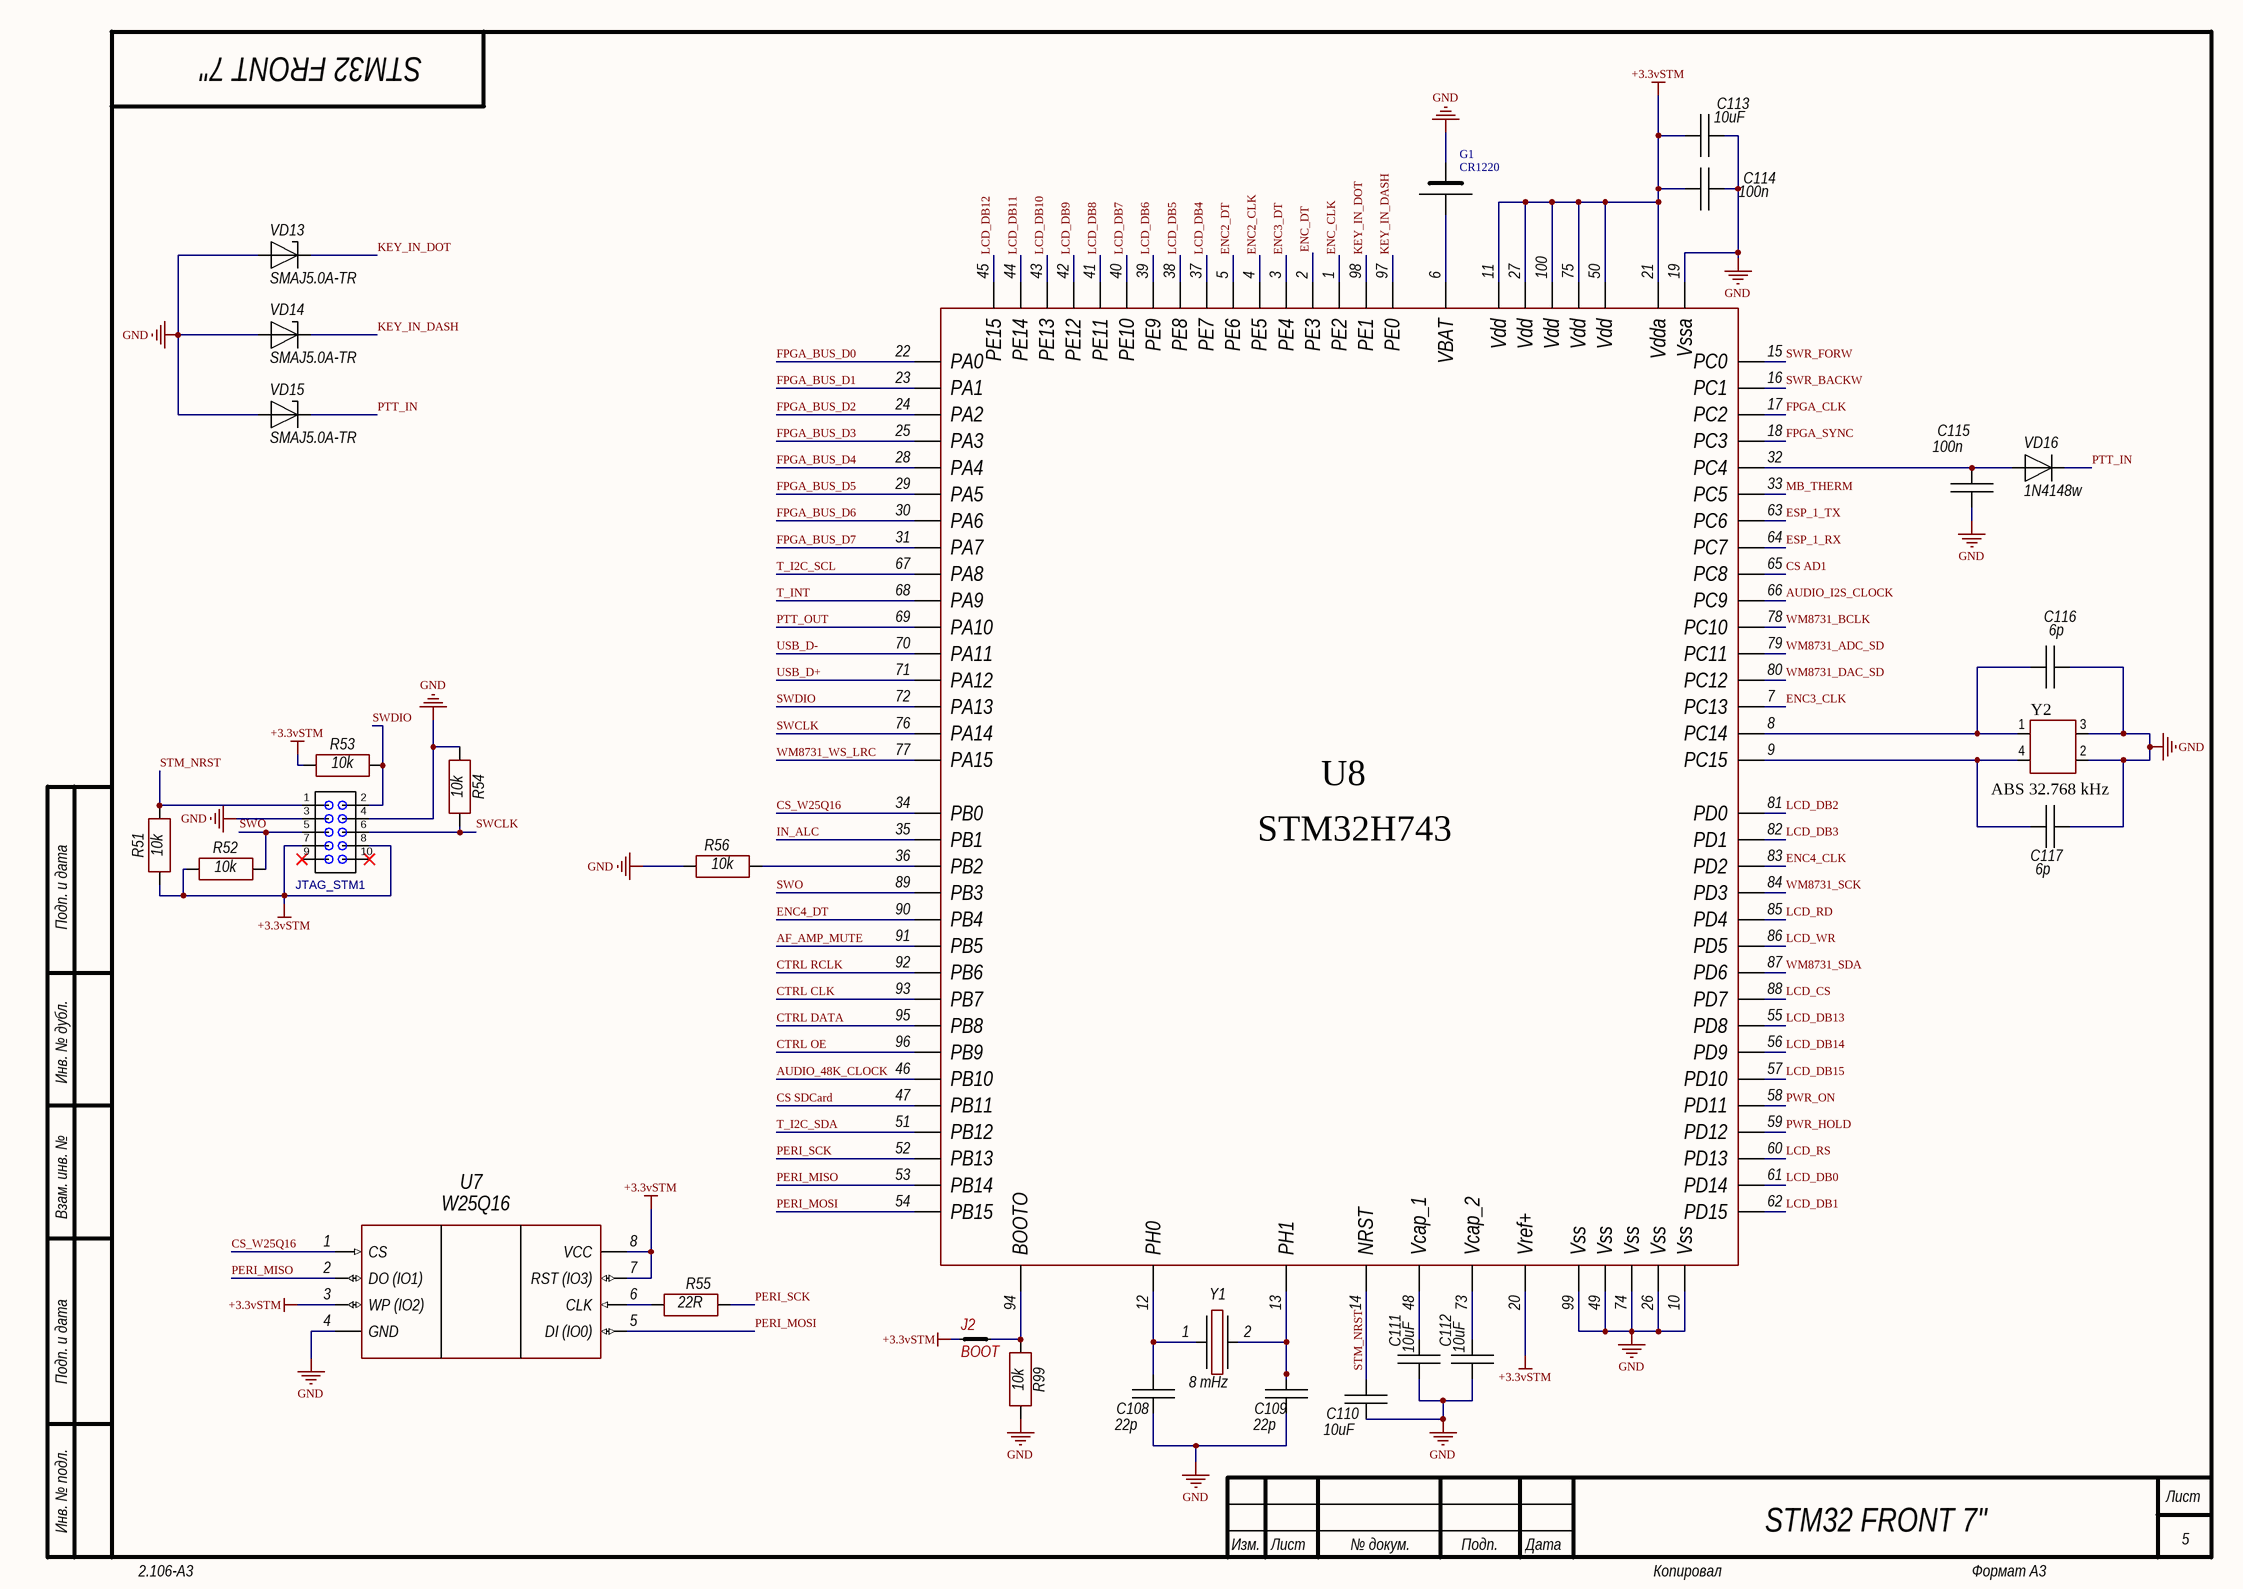
[diagram p4: STM32.SchDoc]

### Parts
C108  22p  [CH0805C]
C109  22p  [CH0805C]
C110  10uF  [CH0805C]
C111  10uF  [CH0805C]
C112  10uF  [CH0805C]
C113  10uF  [CH0805C]
C114  100n  [CH0805C]
C115  100n  [CH0805C]
C116  6p  [CH0805C]
C117  6p  [CH0805C]
G1  CR1220  [CR1220]
J2  BOOT  [CON: PLS-2]
JTAG_STM1  (no value)  [CON: BH-10]
R51  10k  [CH0805R]
R52  10k  [CH0805R]
R53  10k  [CH0805R]
R54  10k  [CH0805R]
R55  22R  [CH0805R]
R56  10k  [CH0805R]
R99  10k  [CH0805R]
U7  W25Q16  [8-SOIC-W]
U8  STM32H743  [100-LQFP]
VD13  SMAJ5.0A-TR  [SMA]
VD14  SMAJ5.0A-TR  [SMA]
VD15  SMAJ5.0A-TR  [SMA]
VD16  1N4148w  [SOD123]
Y1  8 mHz  [OSC-dip]
Y2  ABS 32.768 kHz  [ABS-25]

### Nets
+3.3vSTM: C113.1 C114.1 J2.1 JTAG_STM1.7 JTAG_STM1.8 R51.1 R52.1 R53.1 U7.3(WP_(IO2)) U7.7(RST_(IO3)) U7.8(VCC) U8.11(Vdd) U8.20(Vref+) U8.21(Vdda) U8.27(Vdd) U8.50(Vdd) U8.75(Vdd) U8.100(Vdd)
GND: C108.1 C109.1 C110.1 C111.1 C112.1 C113.2 C114.2 C115.1 C116.2 C117.2 G1.2 JTAG_STM1.3 JTAG_STM1.4 R54.2 R56.1 R99.1 U7.4(GND) U8.10(Vss) U8.19(Vssa) U8.26(Vss) U8.49(Vss) U8.74(Vss) U8.99(Vss) VD13.1(A) VD14.1(A) VD15.1(A) Y2.2 Y2.3
AF_AMP_MUTE: U8.91(PB5)
AUDIO_48K_CLOCK: U8.46(PB10)
AUDIO_I2S_CLOCK: U8.66(PC9)
CS AD1: U8.65(PC8)
CS SDCard: U8.47(PB11)
CS_W25Q16: U7.1(CS) U8.34(PB0)
CTRL CLK: U8.93(PB7)
CTRL DATA: U8.95(PB8)
CTRL OE: U8.96(PB9)
CTRL RCLK: U8.92(PB6)
ENC2_CLK: U8.4(PE5)
ENC2_DT: U8.5(PE6)
ENC3_CLK: U8.7(PC13)
ENC3_DT: U8.3(PE4)
ENC4_CLK: U8.83(PD2)
ENC4_DT: U8.90(PB4)
ENC_CLK: U8.1(PE2)
ENC_DT: U8.2(PE3)
ESP_1_RX: U8.64(PC7)
ESP_1_TX: U8.63(PC6)
FPGA_BUS_D0: U8.22(PA0)
FPGA_BUS_D1: U8.23(PA1)
FPGA_BUS_D2: U8.24(PA2)
FPGA_BUS_D3: U8.25(PA3)
FPGA_BUS_D4: U8.28(PA4)
FPGA_BUS_D5: U8.29(PA5)
FPGA_BUS_D6: U8.30(PA6)
FPGA_BUS_D7: U8.31(PA7)
FPGA_CLK: U8.17(PC2)
FPGA_SYNC: U8.18(PC3)
IN_ALC: U8.35(PB1)
KEY_IN_DASH: U8.97(PE0) VD14.2(C)
KEY_IN_DOT: U8.98(PE1) VD13.2(C)
LCD_CS: U8.88(PD7)
LCD_DB0: U8.61(PD14)
LCD_DB1: U8.62(PD15)
LCD_DB2: U8.81(PD0)
LCD_DB3: U8.82(PD1)
LCD_DB4: U8.37(PE7)
LCD_DB5: U8.38(PE8)
LCD_DB6: U8.39(PE9)
LCD_DB7: U8.40(PE10)
LCD_DB8: U8.41(PE11)
LCD_DB9: U8.42(PE12)
LCD_DB10: U8.43(PE13)
LCD_DB11: U8.44(PE14)
LCD_DB12: U8.45(PE15)
LCD_DB13: U8.55(PD8)
LCD_DB14: U8.56(PD9)
LCD_DB15: U8.57(PD10)
LCD_RD: U8.85(PD4)
LCD_RS: U8.60(PD13)
LCD_WR: U8.86(PD5)
MB_THERM: U8.33(PC5)
PERI_MISO: U7.2(DO_(IO1)) U8.53(PB14)
PERI_MOSI: U7.5(DI_(IO0)) U8.54(PB15)
PERI_SCK: R55.2 U8.52(PB13)
PTT_IN: VD15.2(C) VD16.2
PTT_OUT: U8.69(PA10)
PWR_HOLD: U8.59(PD12)
PWR_ON: U8.58(PD11)
STM_NRST: C110.2 JTAG_STM1.1 R51.2 U8.14(NRST)
SWCLK: JTAG_STM1.6 R54.1 U8.76(PA14)
SWDIO: JTAG_STM1.2 R53.2 U8.72(PA13)
SWO: JTAG_STM1.5 R52.2 U8.89(PB3)
SWR_BACKW: U8.16(PC1)
SWR_FORW: U8.15(PC0)
T_I2C_SCL: U8.67(PA8)
T_I2C_SDA: U8.51(PB12)
T_INT: U8.68(PA9)
USB_D+: U8.71(PA12)
USB_D-: U8.70(PA11)
WM8731_ADC_SD: U8.79(PC11)
WM8731_BCLK: U8.78(PC10)
WM8731_DAC_SD: U8.80(PC12)
WM8731_SCK: U8.84(PD3)
WM8731_SDA: U8.87(PD6)
WM8731_WS_LRC: U8.77(PA15)
NetC108_2: C108.2 U8.12(PH0) Y1.1
NetC109_2: C109.2 U8.13(PH1) Y1.2
NetC111_2: C111.2 U8.48(Vcap_1)
NetC112_2: C112.2 U8.73(Vcap_2)
NetC115_2: C115.2 U8.32(PC4) VD16.1
NetC116_1: C116.1 U8.8(PC14) Y2.1
NetC117_1: C117.1 U8.9(PC15) Y2.4
NetG1_1: G1.1 U8.6(VBAT)
NetJ2_2: J2.2 R99.2 U8.94(BOOTO)
NetR55_1: R55.1 U7.6(CLK)
NetR56_2: R56.2 U8.36(PB2)

Not connected (* = marked no-connect by the designer): JTAG_STM1 9* 10*

### Notes on the sheet
- Подп. и дата
- Инв. № дубл.
- Взам. инв. №
- Инв. № подл.
- Изм.
- Лист
- № докум.
- Подп.
- Дата
- 2.106-A3
- Копировал
- Формат А3

### Library data of the parts
C108-C117 = Capacitor: Manufacturer: *; Model: *; HelpURL: *; ComponentKind: *; Value: *
G1 = POWER_BAT
J2 = DJAMPER
JTAG_STM1 = IDC10: 2*5 Pin
R51-R56 R99 = Resistor: Manufacturer: *; Model: *; HelpURL: *; ComponentKind: *; Value: *
U7 = W25Q32JVZPIQ: Flash; Manufacturer: Winbond Electronics; Model: W25Q32JVZPIQ; HelpURL: https://www.digikey.com/product-detail/en/winbond-electronics/W25Q32JVZPIQ/W25Q32JVZPIQ-ND/6167525; ComponentKind: 8-WSON
VD13-VD15 = Diod Zener: ComponentKind: *; Manufacturer: *; Model: *; HelpURL: *
VD16 = Diod: ComponentKind: *; Manufacturer: *; Model: *; HelpURL: *
Y1 = Oscillator: Manufacturer: *; Model: *; HelpURL: *; ComponentKind: *; Value: *
Y2 = ABS25

## Sheet Control.SchDoc
size 420 x 297 mm; DocumentNumber: Control, Wolf-2; SheetNumber: 6; SheetTotal: 6
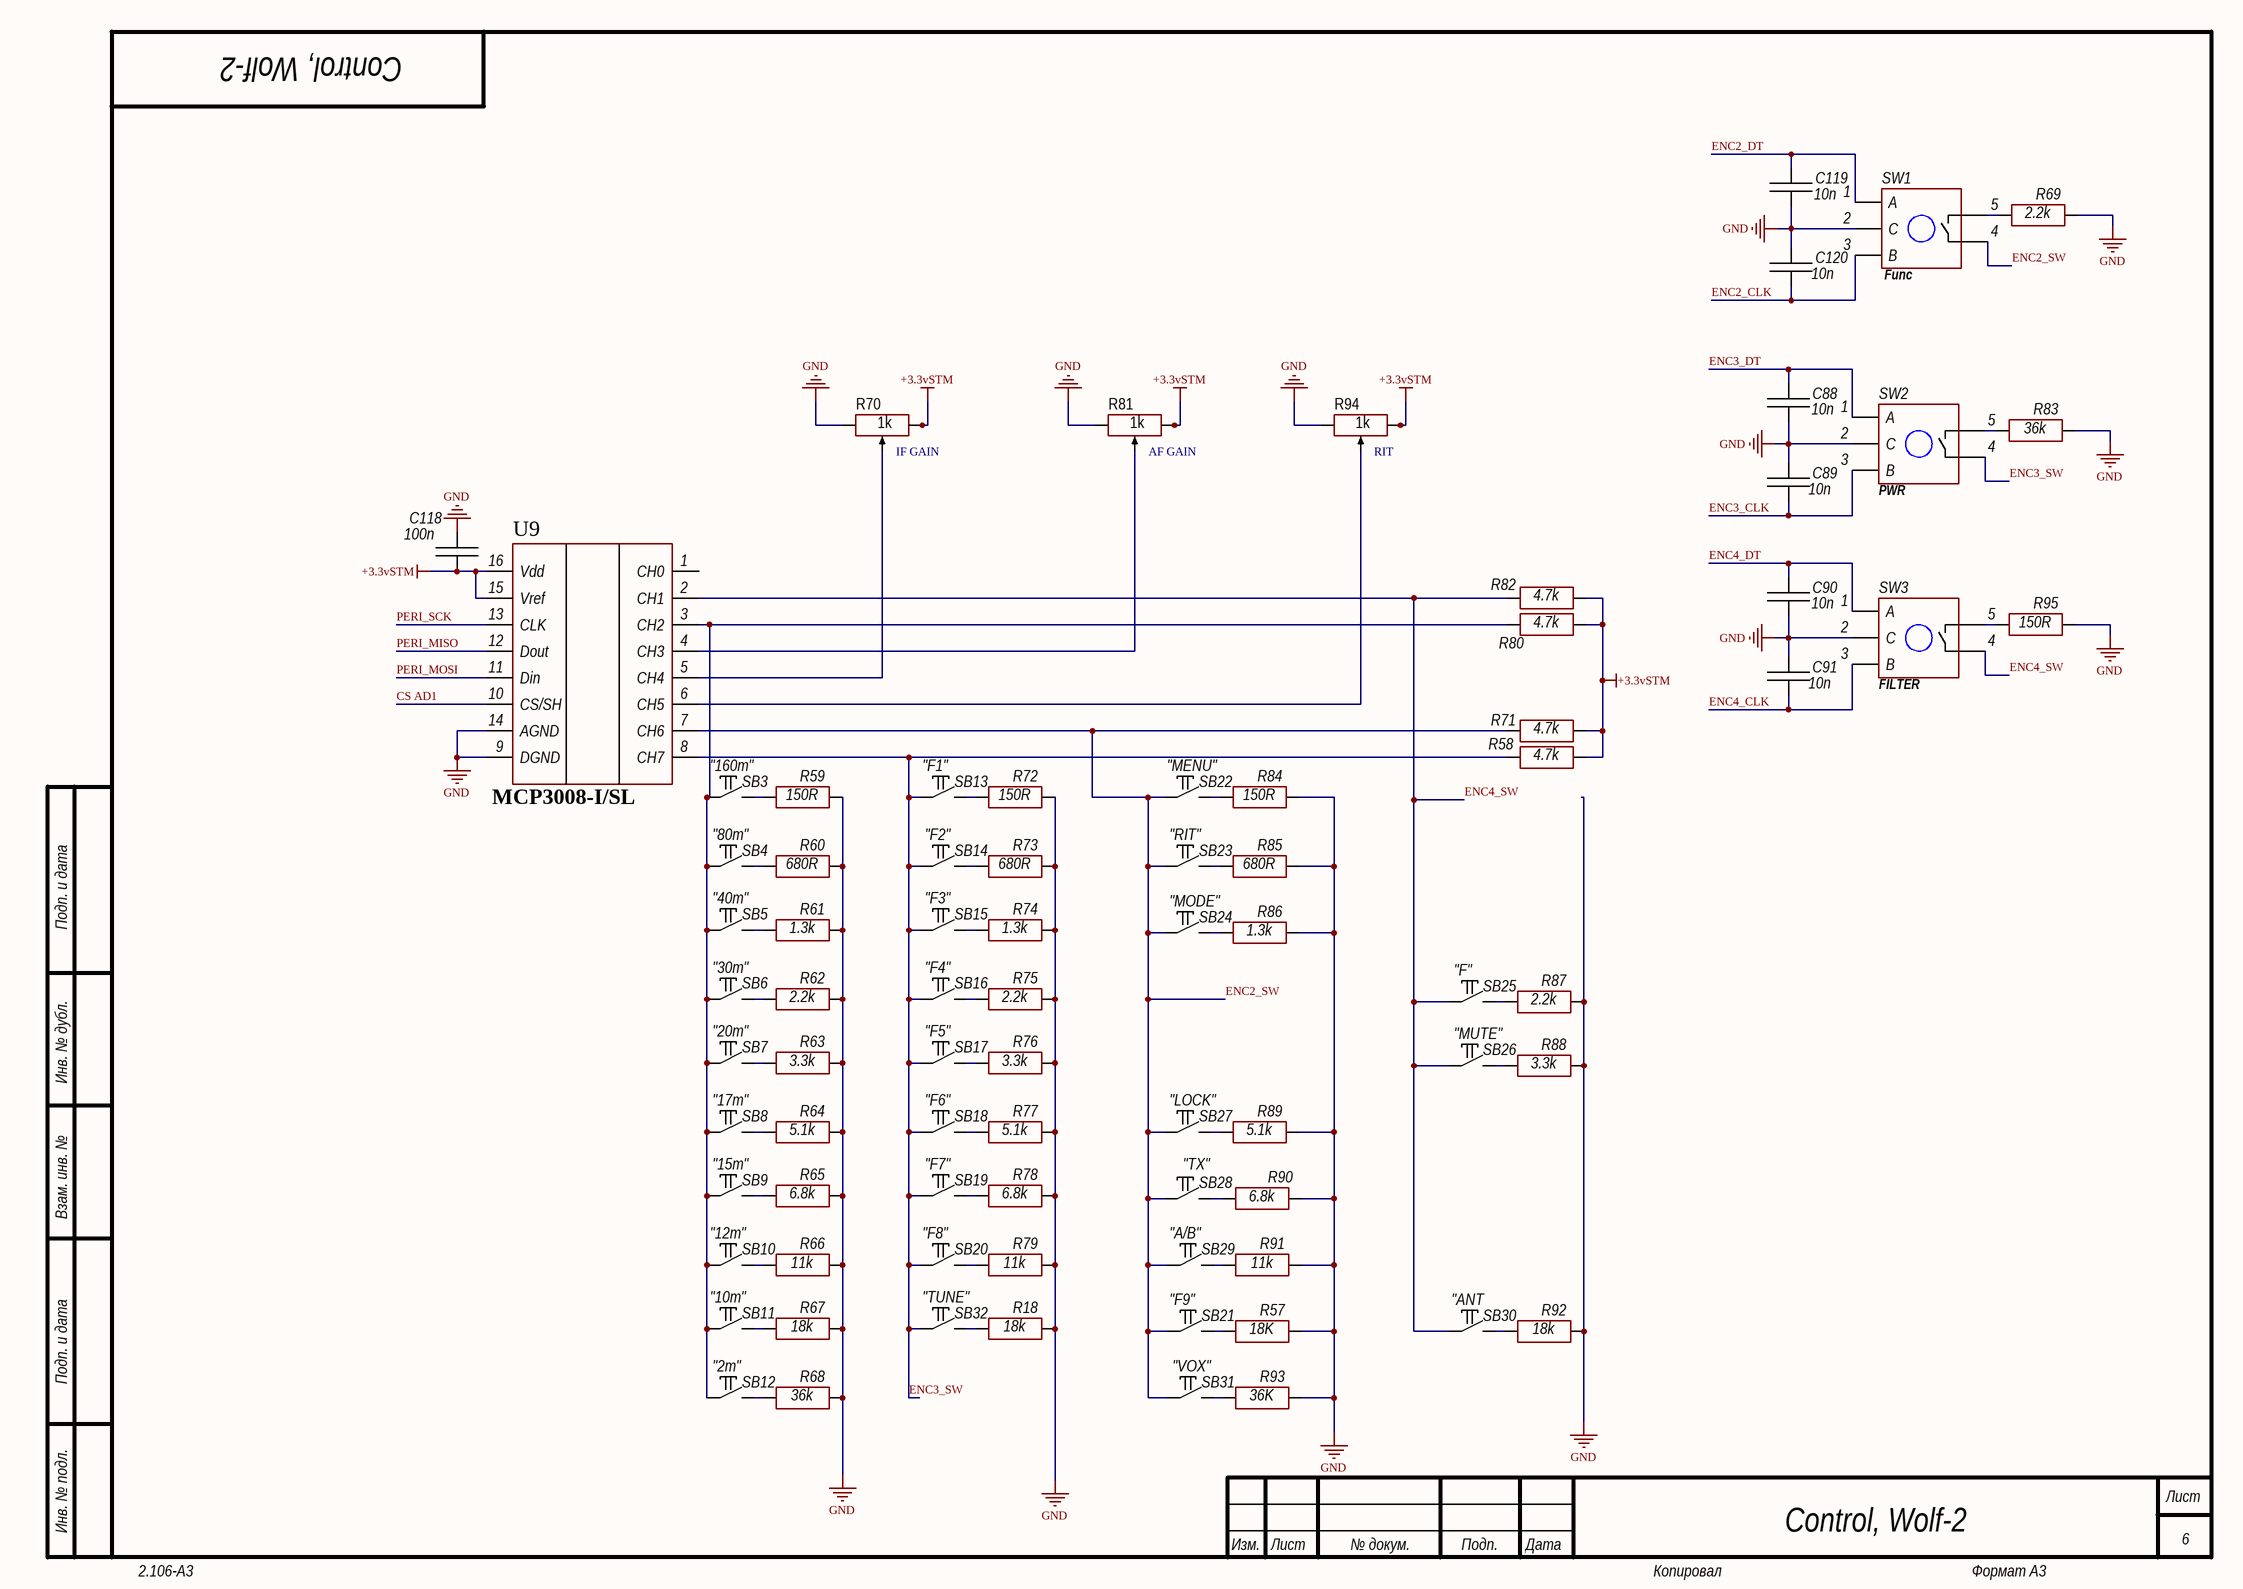
[diagram p5: Control.SchDoc]

### Parts
C88  10n  [CH0805C]
C89  10n  [CH0805C]
C90  10n  [CH0805C]
C91  10n  [CH0805C]
C118  100n  [CH0805C]
C119  10n  [CH0805C]
C120  10n  [CH0805C]
R18  18k  [CH0805R]
R57  18K  [CH0805R]
R58  4.7k  [CH0805R]
R59  150R  [CH0805R]
R60  680R  [CH0805R]
R61  1.3k  [CH0805R]
R62  2.2k  [CH0805R]
R63  3.3k  [CH0805R]
R64  5.1k  [CH0805R]
R65  6.8k  [CH0805R]
R66  11k  [CH0805R]
R67  18k  [CH0805R]
R68  36k  [CH0805R]
R69  2.2k  [CH0805R]
R70  1k  [PTV09]
R71  4.7k  [CH0805R]
R72  150R  [CH0805R]
R73  680R  [CH0805R]
R74  1.3k  [CH0805R]
R75  2.2k  [CH0805R]
R76  3.3k  [CH0805R]
R77  5.1k  [CH0805R]
R78  6.8k  [CH0805R]
R79  11k  [CH0805R]
R80  4.7k  [CH0805R]
R81  1k  [PTV09]
R82  4.7k  [CH0805R]
R83  36k  [CH0805R]
R84  150R  [CH0805R]
R85  680R  [CH0805R]
R86  1.3k  [CH0805R]
R87  2.2k  [CH0805R]
R88  3.3k  [CH0805R]
R89  5.1k  [CH0805R]
R90  6.8k  [CH0805R]
R91  11k  [CH0805R]
R92  18k  [CH0805R]
R93  36K  [CH0805R]
R94  1k  [PTV09]
R95  150R  [CH0805R]
SB3  "160m"  [BUT: 6x6]
SB4  "80m"  [BUT: 6x6]
SB5  "40m"  [BUT: 6x6]
SB6  "30m"  [BUT: 6x6]
SB7  "20m"  [BUT: 6x6]
SB8  "17m"  [BUT: 6x6]
SB9  "15m"  [BUT: 6x6]
SB10  "12m"  [BUT: 6x6]
SB11  "10m"  [BUT: 6x6]
SB12  "2m"  [BUT: 6x6]
SB13  "F1"  [BUT: 6x6]
SB14  "F2"  [BUT: 6x6]
SB15  "F3"  [BUT: 6x6]
SB16  "F4"  [BUT: 6x6]
SB17  "F5"  [BUT: 6x6]
SB18  "F6"  [BUT: 6x6]
SB19  "F7"  [BUT: 6x6]
SB20  "F8"  [BUT: 6x6]
SB21  "F9"  [BUT: 6x6]
SB22  "MENU"  [BUT: 6x6]
SB23  "RIT"  [BUT: 6x6]
SB24  "MODE"  [BUT: 6x6]
SB25  "F"  [BUT: 6x6]
SB26  "MUTE"  [BUT: 6x6]
SB27  "LOCK"  [BUT: 6x6]
SB28  "TX"  [BUT: 6x6]
SB29  "A/B"  [BUT: 6x6]
SB30  "ANT  [BUT: 6x6]
SB31  "VOX"  [BUT: 6x6]
SB32  "TUNE"  [BUT: 6x6]
SW1  Func  [ENC: PEC-12]
SW2  PWR  [ENC: PEC-12]
SW3  FILTER  [ENC: PEC-12]
U9  MCP3008-I/SL  [16-SOIC]

### Nets
+3.3vSTM: C118.1 R58.2 R70.1 R71.2 R80.2 R81.1 R82.2 R94.1 U9.15(Vref) U9.16(Vdd)
GND: C88.1 C89.2 C90.1 C91.2 C118.2 C119.1 C120.2 R18.2 R57.2 R59.2 R60.2 R61.2 R62.2 R63.2 R64.2 R65.2 R66.2 R67.2 R68.2 R69.2 R70.3 R72.2 R73.2 R74.2 R75.2 R76.2 R77.2 R78.2 R79.2 R81.3 R83.2 R84.2 R85.2 R86.2 R87.2 R88.2 R89.2 R90.2 R91.2 R92.2 R93.2 R94.3 R95.2 SW1.2(C) SW2.2(C) SW3.2(C) U9.9(DGND) U9.14(AGND)
CS AD1: U9.10(CS/SH)
ENC2_CLK: C120.1 SW1.3(B)
ENC2_DT: C119.2 SW1.1(A)
ENC2_SW: R71.1 SB21.1 SB22.1 SB23.1 SB24.1 SB27.1 SB28.1 SB29.1 SB31.1 SW1.4 U9.7(CH6)
ENC3_CLK: C89.1 SW2.3(B)
ENC3_DT: C88.2 SW2.1(A)
ENC3_SW: R58.1 SB13.1 SB14.1 SB15.1 SB16.1 SB17.1 SB18.1 SB19.1 SB20.1 SB32.1 SW2.4 U9.8(CH7)
ENC4_CLK: C91.1 SW3.3(B)
ENC4_DT: C90.2 SW3.1(A)
ENC4_SW: R82.1 SB25.1 SB26.1 SB30.1 SW3.4 U9.2(CH1)
PERI_MISO: U9.12(Dout)
PERI_MOSI: U9.11(Din)
PERI_SCK: U9.13(CLK)
NetR18_1: R18.1 SB32.2
NetR57_1: R57.1 SB21.2
NetR59_1: R59.1 SB3.2
NetR60_1: R60.1 SB4.2
NetR61_1: R61.1 SB5.2
NetR62_1: R62.1 SB6.2
NetR63_1: R63.1 SB7.2
NetR64_1: R64.1 SB8.2
NetR65_1: R65.1 SB9.2
NetR66_1: R66.1 SB10.2
NetR67_1: R67.1 SB11.2
NetR68_1: R68.1 SB12.2
NetR69_1: R69.1 SW1.5
NetR70_2: R70.2 U9.5(CH4)
NetR72_1: R72.1 SB13.2
NetR73_1: R73.1 SB14.2
NetR74_1: R74.1 SB15.2
NetR75_1: R75.1 SB16.2
NetR76_1: R76.1 SB17.2
NetR77_1: R77.1 SB18.2
NetR78_1: R78.1 SB19.2
NetR79_1: R79.1 SB20.2
NetR80_1: R80.1 SB3.1 SB4.1 SB5.1 SB6.1 SB7.1 SB8.1 SB9.1 SB10.1 SB11.1 SB12.1 U9.3(CH2)
NetR81_2: R81.2 U9.4(CH3)
NetR83_1: R83.1 SW2.5
NetR84_1: R84.1 SB22.2
NetR85_1: R85.1 SB23.2
NetR86_1: R86.1 SB24.2
NetR87_1: R87.1 SB25.2
NetR88_1: R88.1 SB26.2
NetR89_1: R89.1 SB27.2
NetR90_1: R90.1 SB28.2
NetR91_1: R91.1 SB29.2
NetR92_1: R92.1 SB30.2
NetR93_1: R93.1 SB31.2
NetR94_2: R94.2 U9.6(CH5)
NetR95_1: R95.1 SW3.5

Not connected (* = marked no-connect by the designer): U9 1(CH0)

### Notes on the sheet
- (near R70) IF GAIN
- (near R81) AF GAIN
- (near R94) RIT
- Подп. и дата
- Инв. № дубл.
- Взам. инв. №
- Инв. № подл.
- Изм.
- Лист
- № докум.
- Подп.
- Дата
- 2.106-A3
- Копировал
- Формат А3

### Library data of the parts
C88-C91 C118-C120 = Capacitor: Manufacturer: *; Model: *; HelpURL: *; ComponentKind: *; Value: *
R18 R57-R69 R71-R80 R82-R93 R95 = Resistor: Manufacturer: *; Model: *; HelpURL: *; ComponentKind: *; Value: *
R70 R81 R94 = Trimmer: Manufacturer: Bourns; PartNumber: 3296W-1-103LF; ValueManufacturerPartNumber: Resistor film, 1k, ±10%, 3296W, 0.5W, -55...+125°C; TypeResistor: Resistor film; Power: 0.5W; Tolerance: ±10%; Package: 3296W; HelpURL: https://www.digikey.com/product-detail/en/bourns-inc/3296W-1-103LF/3296W-103LF-ND/1088045; Temperature: -55...+125°C; Value: 1k
SB3-SB32 = Tactile switches: 6x6 mm; Manufacturer: *; Model: *; HelpURL: *; ComponentKind: *
SW1-SW3 = PEC12: Encoder; Model: *; Manufacturer: *; HelpURL: *; ComponentKind: *

## Nets that join several sheets
+3.3vCOD: Power (C67.1 C68.2 FB4.1), Codec (5 pins)
+3.3vLCD: LCD (18 pins), Power (L5.1 VD8.2)
+3.3vSTM: Power (9 pins), Conn (C77.2 C79.2 FB6.2 MicroSD1.4), STM32 (18 pins), Control (10 pins)
+5v: Power (5 pins), Conn (6 pins)
+12: Power (20 pins), Conn (C81.1 X6.25 X6.26)
+12RB: Power (C75.1 C76.2 FB5.1), Conn (X4.10)
GND: LCD (85 pins), Power (45 pins), Conn (25 pins), Codec (24 pins), STM32 (28 pins), Control (48 pins)
AF_AMP_MUTE: Conn (X4.1), STM32 (U8.91)
AUDIO_48K_CLOCK: Conn (X6.19), STM32 (U8.46)
AUDIO_I2S_CLOCK: Conn (X6.20), Codec (U6.25), STM32 (U8.66)
CS AD1: STM32 (U8.65), Control (U9.10)
CS SDCard: Conn (MicroSD1.2 R37.1), STM32 (U8.47)
CTRL CLK: Conn (X6.3), STM32 (U8.93)
CTRL DATA: Conn (X6.4), STM32 (U8.95)
CTRL OE: Conn (X6.5), STM32 (U8.96)
CTRL RCLK: Conn (X6.2), STM32 (U8.92)
DCDC_SYNC: Power (U4.5 U5.5), Conn (X6.21)
ENC2_CLK: STM32 (U8.4), Control (C120.1 SW1.3)
ENC2_DT: STM32 (U8.5), Control (C119.2 SW1.1)
ENC3_CLK: STM32 (U8.7), Control (C89.1 SW2.3)
ENC3_DT: STM32 (U8.3), Control (C88.2 SW2.1)
ENC4_CLK: STM32 (U8.83), Control (C91.1 SW3.3)
ENC4_DT: STM32 (U8.90), Control (C90.2 SW3.1)
ENC_CLK: Conn (C85.2 X7.2), STM32 (U8.1)
ENC_DT: Conn (C84.2 X7.1), STM32 (U8.2)
ESP_1_RX: Conn (R39.2), STM32 (U8.64)
ESP_1_TX: Conn (R40.2), STM32 (U8.63)
FPGA_BUS_D0: Conn (X6.10), STM32 (U8.22)
FPGA_BUS_D1: Conn (X6.11), STM32 (U8.23)
FPGA_BUS_D2: Conn (X6.12), STM32 (U8.24)
FPGA_BUS_D3: Conn (X6.13), STM32 (U8.25)
FPGA_BUS_D4: Conn (X6.14), STM32 (U8.28)
FPGA_BUS_D5: Conn (X6.15), STM32 (U8.29)
FPGA_BUS_D6: Conn (X6.16), STM32 (U8.30)
FPGA_BUS_D7: Conn (X6.17), STM32 (U8.31)
FPGA_CLK: Conn (X6.8), STM32 (U8.17)
FPGA_SYNC: Conn (X6.9), STM32 (U8.18)
IN_ALC: Conn (X6.1), STM32 (U8.35)
KEY_IN_DASH: Conn (X4.5), STM32 (U8.97 VD14.2)
KEY_IN_DOT: Conn (X4.3), STM32 (U8.98 VD13.2)
LCD_CS: LCD (IC1.79), STM32 (U8.88)
LCD_DB0: LCD (IC1.82), STM32 (U8.61)
LCD_DB1: LCD (IC1.83), STM32 (U8.62)
LCD_DB2: LCD (IC1.84), STM32 (U8.81)
LCD_DB3: LCD (IC1.88), STM32 (U8.82)
LCD_DB4: LCD (IC1.89), STM32 (U8.37)
LCD_DB5: LCD (IC1.90), STM32 (U8.38)
LCD_DB6: LCD (IC1.91), STM32 (U8.39)
LCD_DB7: LCD (IC1.92), STM32 (U8.40)
LCD_DB8: LCD (IC1.93), STM32 (U8.41)
LCD_DB9: LCD (IC1.94), STM32 (U8.42)
LCD_DB10: LCD (IC1.95), STM32 (U8.43)
LCD_DB11: LCD (IC1.96), STM32 (U8.44)
LCD_DB12: LCD (IC1.97), STM32 (U8.45)
LCD_DB13: LCD (IC1.98), STM32 (U8.55)
LCD_DB14: LCD (IC1.99), STM32 (U8.56)
LCD_DB15: LCD (IC1.100), STM32 (U8.57)
LCD_RD: LCD (IC1.77), STM32 (U8.85)
LCD_RS: LCD (IC1.80), STM32 (U8.60)
LCD_WR: LCD (IC1.78), STM32 (U8.86)
LHP_OUT_DAC: Conn (R96.2 XJ1.3), Codec (C103.2 R46.1 VD10.2)
LINE_IN1: Conn (X5.1), Codec (R44.2)
LINE_IN2: Conn (X5.2), Codec (R45.2)
MB_THERM: Conn (X6.18), STM32 (U8.33)
MIC: Conn (XM1.1), Codec (5 pins)
PERI_MISO: Conn (MicroSD1.7 R38.1), STM32 (U7.2 U8.53), Control (U9.12)
PERI_MOSI: Conn (MicroSD1.3 R36.1), STM32 (U7.5 U8.54), Control (U9.11)
PERI_SCK: Conn (MicroSD1.5 R35.1), STM32 (R55.2 U8.52), Control (U9.13)
PTT_IN: Conn (X4.8 XM1.5), STM32 (VD15.2 VD16.2)
PTT_OUT: Conn (X4.2), STM32 (U8.69)
PWR_HOLD: Power (Q2.1 R28.2), STM32 (U8.59)
PWR_ON: Power (C50.1 VD7.1), STM32 (U8.58)
RHP_OUT_DAC: Conn (R97.2 XJ1.2), Codec (C102.2 R47.1 VD11.2)
SWR_BACKW: Conn (X6.7), STM32 (U8.16)
SWR_FORW: Conn (X6.6), STM32 (U8.15)
T_I2C_SCL: LCD (J1.6), Conn (X3.3), STM32 (U8.67)
T_I2C_SDA: LCD (J1.5), Conn (X3.1), STM32 (U8.51)
T_INT: LCD (J1.4), STM32 (U8.68)
USB_D+: Conn (X4.6), STM32 (U8.71)
USB_D-: Conn (X4.4), STM32 (U8.70)
WM8731_ADC_SD: Codec (U6.6), STM32 (U8.79)
WM8731_BCLK: Codec (U6.3), STM32 (U8.78)
WM8731_DAC_SD: Codec (U6.4), STM32 (U8.80)
WM8731_SCK: Codec (U6.24), STM32 (U8.84)
WM8731_SDA: Codec (U6.23), STM32 (U8.87)
WM8731_WS_LRC: Codec (U6.5 U6.7), STM32 (U8.77)